# EAGLE design tNode-8 (EAGLE 7.6.0)

## Sheet 1 of 6
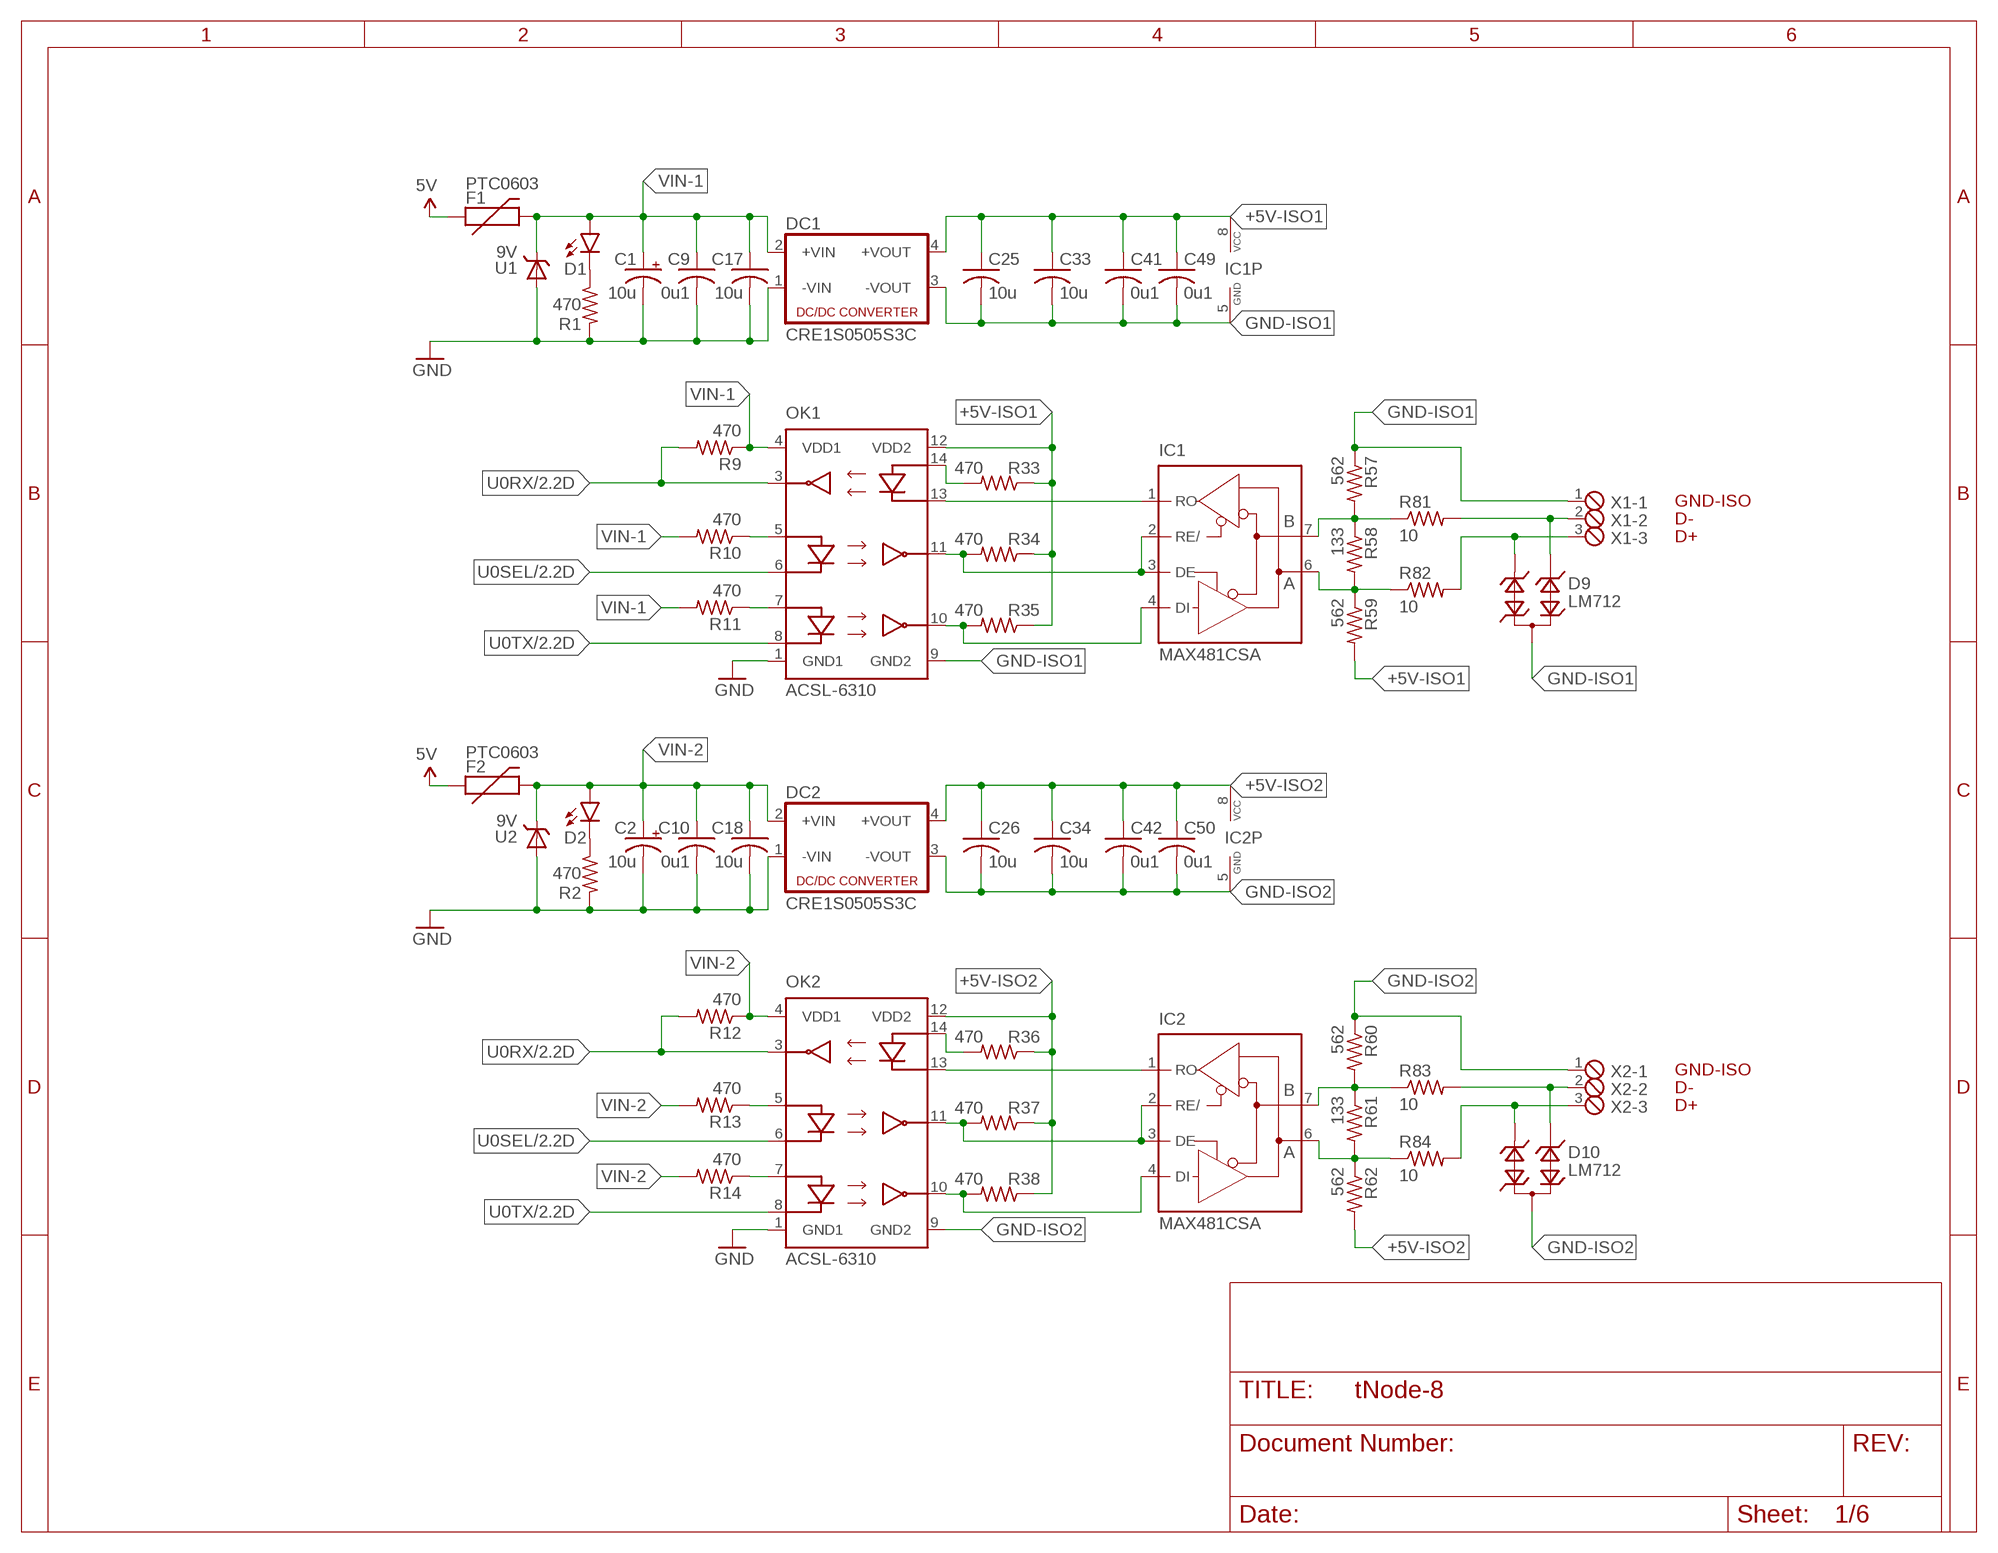
[diagram p0: schematic, sheet 1]

### Parts
C1  10u  CPOL-USE2.5-5-NOSILK  [E2,5-5-NOSILK]
C2  10u  CPOL-USE2.5-5-NOSILK  [E2,5-5-NOSILK]
C9  0u1  C-USC0603K  [C0603K]
C10  0u1  C-USC0603K  [C0603K]
C17  10u  C-USC0603K  [C0603K]
C18  10u  C-USC0603K  [C0603K]
C25  10u  C-USC0603K  [C0603K]
C26  10u  C-USC0603K  [C0603K]
C33  10u  C-USC0603K  [C0603K]
C34  10u  C-USC0603K  [C0603K]
C41  0u1  C-USC0603K  [C0603K]
C42  0u1  C-USC0603K  [C0603K]
C49  0u1  C-USC0603K  [C0603K]
C50  0u1  C-USC0603K  [C0603K]
D1  LED0603  [LED-0603]
D2  LED0603  [LED-0603]
D9  LM712  CDSOT23-SM712SOT23-STANDARD  [SOT23]
D10  LM712  CDSOT23-SM712SOT23-STANDARD  [SOT23]
DC1  CRE1S0505S3C  VA-0505S  [4SIL]
DC2  CRE1S0505S3C  VA-0505S  [4SIL]
F1  PTC0603  [0603]
F2  PTC0603  [0603]
IC1  MAX481CSA  [SO08]
IC2  MAX481CSA  [SO08]
OK1  ACSL-6310  ACSL-60  [SO-16]
OK2  ACSL-6310  ACSL-60  [SO-16]
R1  470  R-US_R0603  [R0603]
R2  470  R-US_R0603  [R0603]
R9  470  R-US_R0603  [R0603]
R10  470  R-US_R0603  [R0603]
R11  470  R-US_R0603  [R0603]
R12  470  R-US_R0603  [R0603]
R13  470  R-US_R0603  [R0603]
R14  470  R-US_R0603  [R0603]
R33  470  R-US_R0603  [R0603]
R34  470  R-US_R0603  [R0603]
R35  470  R-US_R0603  [R0603]
R36  470  R-US_R0603  [R0603]
R37  470  R-US_R0603  [R0603]
R38  470  R-US_R0603  [R0603]
R57  562  R-US_R0603  [R0603]
R58  133  R-US_R0603  [R0603]
R59  562  R-US_R0603  [R0603]
R60  562  R-US_R0603  [R0603]
R61  133  R-US_R0603  [R0603]
R62  562  R-US_R0603  [R0603]
R81  10  R-US_R0603  [R0603]
R82  10  R-US_R0603  [R0603]
R83  10  R-US_R0603  [R0603]
R84  10  R-US_R0603  [R0603]
U1  9V  TVS-DIODESOD323-NOSILK  [SOD323-NOSILK]
U2  9V  TVS-DIODESOD323-NOSILK  [SOD323-NOSILK]
X1  MPT3  [3POL254]
X2  MPT3  [3POL254]

### Nets
5V: F1.1 F2.1 ; also sheet 2,3,4,5
+5V-ISO1: C25.1 C33.1 C41.1 C49.1 DC1.4(+VOUT) IC1.8(VCC) OK1.12(VDD2) R33.1 R34.1 R35.1 R59.2
+5V-ISO2: C26.1 C34.1 C42.1 C50.1 DC2.4(+VOUT) IC2.8(VCC) OK2.12(VDD2) R36.1 R37.1 R38.1 R62.2
GND: C1.- C2.- C9.2 C10.2 C17.2 C18.2 DC1.1(-VIN) DC2.1(-VIN) OK1.1(GND1) OK2.1(GND1) R1.2 R2.2 U1.A U2.A ; also sheet 2,3,4,5
GND-ISO1: C25.2 C33.2 C41.2 C49.2 D9.3 DC1.3(-VOUT) IC1.5(GND) OK1.9(GND2) R57.1 X1.1
GND-ISO2: C26.2 C34.2 C42.2 C50.2 D10.3 DC2.3(-VOUT) IC2.5(GND) OK2.9(GND2) R60.1 X2.1
N$1: IC2.7(B) R60.2 R61.1 R83.1
N$2: IC1.7(B) R57.2 R58.1 R81.1
N$3: IC1.6(A) R58.2 R59.1 R82.1
N$4: IC2.6(A) R61.2 R62.1 R84.1
N$5: IC2.1(RO) OK2.13(C3)
N$6: IC2.2(RE/) IC2.3(DE) OK2.11(VO1) R37.2
N$7: OK2.5(A1) R13.1
N$8: OK2.7(A2) R14.1
N$9: OK2.14(A3) R36.2
N$10: IC1.1(RO) OK1.13(C3)
N$11: D2.C R2.1
N$12: D10.1 R83.2 X2.2
N$13: D10.2 R84.2 X2.3
N$18: IC1.2(RE/) IC1.3(DE) OK1.11(VO1) R34.2
N$19: OK1.5(A1) R10.1
N$21: OK1.7(A2) R11.1
N$23: OK1.14(A3) R33.2
N$25: D1.C R1.1
N$27: D9.1 R81.2 X1.2
N$28: D9.2 R82.2 X1.3
OPTO-OUT1: IC1.4(DI) OK1.10(VO2) R35.2
OPTO-OUT2: IC2.4(DI) OK2.10(VO2) R38.2
U0RX: OK1.3(V03) OK2.3(V03) R9.2 R12.2 ; also sheet 2,3,4,5
U0SEL: OK1.6(C1) OK2.6(C1) ; also sheet 2,3,4
U0TX: OK1.8(C2) OK2.8(C2) ; also sheet 2,3,4,5
VIN-1: C1.+ C9.1 C17.1 D1.A DC1.2(+VIN) F1.2 OK1.4(VDD1) R9.1 R10.2 R11.2 U1.C
VIN-2: C2.+ C10.1 C18.1 D2.A DC2.2(+VIN) F2.2 OK2.4(VDD1) R12.1 R13.2 R14.2 U2.C

### Notes on the sheet
- GND-ISO
- D-
- D+
- GND-ISO
- D-
- D+

## Sheet 2 of 6
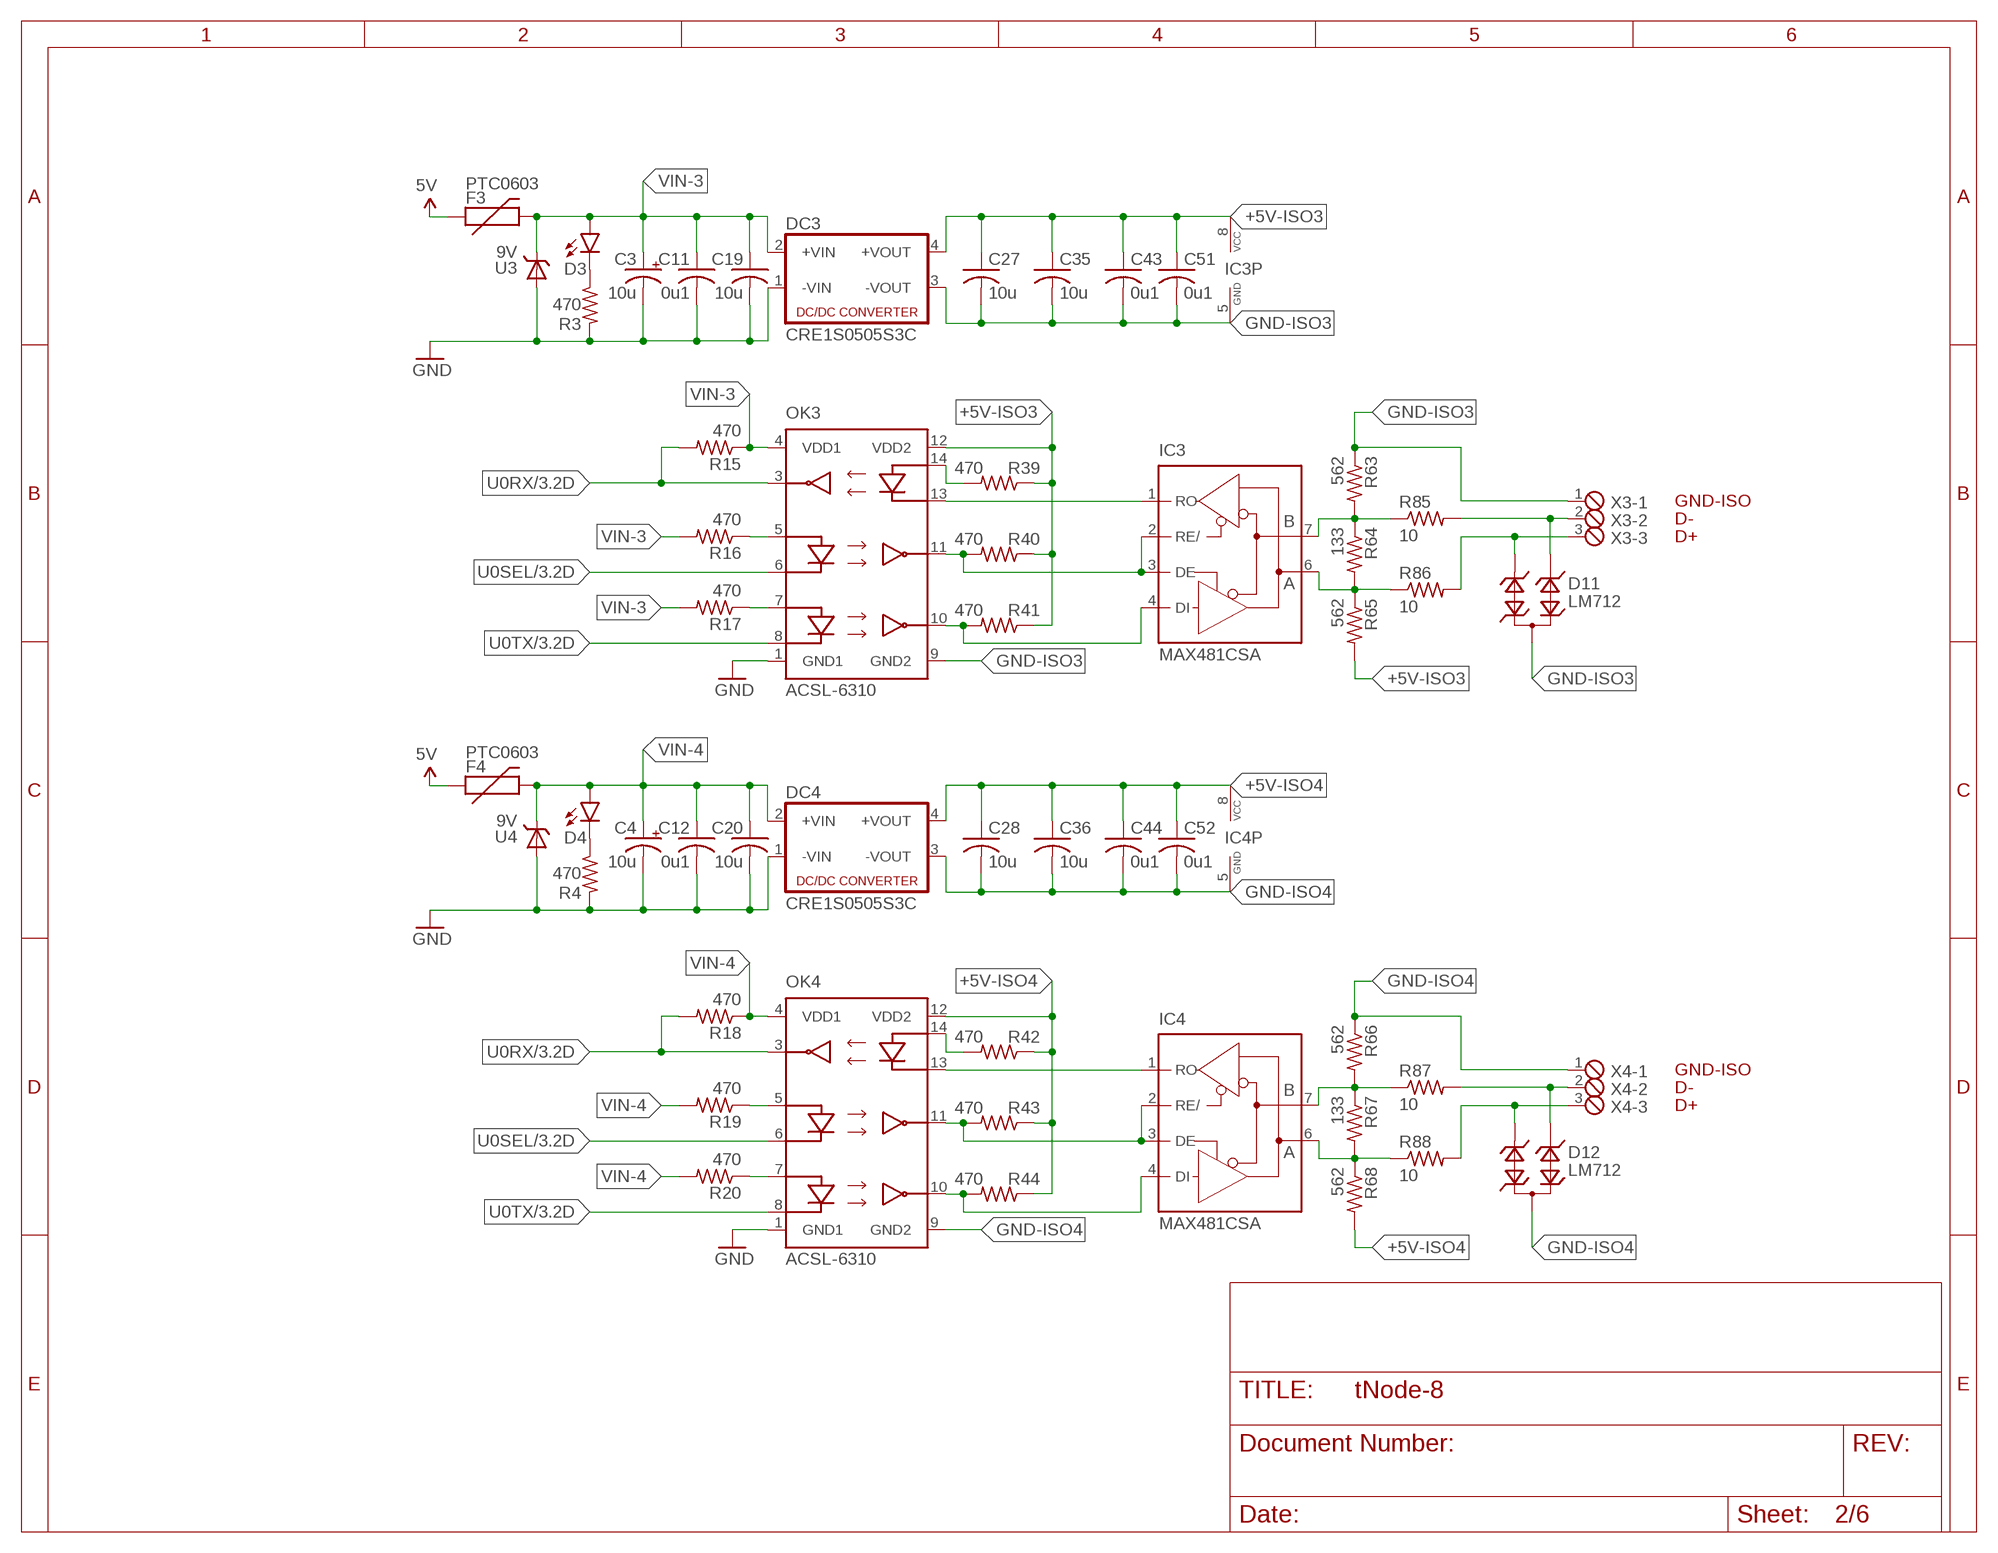
[diagram p1: schematic, sheet 2]

### Parts
C3  10u  CPOL-USE2.5-5-NOSILK  [E2,5-5-NOSILK]
C4  10u  CPOL-USE2.5-5-NOSILK  [E2,5-5-NOSILK]
C11  0u1  C-USC0603K  [C0603K]
C12  0u1  C-USC0603K  [C0603K]
C19  10u  C-USC0603K  [C0603K]
C20  10u  C-USC0603K  [C0603K]
C27  10u  C-USC0603K  [C0603K]
C28  10u  C-USC0603K  [C0603K]
C35  10u  C-USC0603K  [C0603K]
C36  10u  C-USC0603K  [C0603K]
C43  0u1  C-USC0603K  [C0603K]
C44  0u1  C-USC0603K  [C0603K]
C51  0u1  C-USC0603K  [C0603K]
C52  0u1  C-USC0603K  [C0603K]
D3  LED0603  [LED-0603]
D4  LED0603  [LED-0603]
D11  LM712  CDSOT23-SM712SOT23-STANDARD  [SOT23]
D12  LM712  CDSOT23-SM712SOT23-STANDARD  [SOT23]
DC3  CRE1S0505S3C  VA-0505S  [4SIL]
DC4  CRE1S0505S3C  VA-0505S  [4SIL]
F3  PTC0603  [0603]
F4  PTC0603  [0603]
IC3  MAX481CSA  [SO08]
IC4  MAX481CSA  [SO08]
OK3  ACSL-6310  ACSL-60  [SO-16]
OK4  ACSL-6310  ACSL-60  [SO-16]
R3  470  R-US_R0603  [R0603]
R4  470  R-US_R0603  [R0603]
R15  470  R-US_R0603  [R0603]
R16  470  R-US_R0603  [R0603]
R17  470  R-US_R0603  [R0603]
R18  470  R-US_R0603  [R0603]
R19  470  R-US_R0603  [R0603]
R20  470  R-US_R0603  [R0603]
R39  470  R-US_R0603  [R0603]
R40  470  R-US_R0603  [R0603]
R41  470  R-US_R0603  [R0603]
R42  470  R-US_R0603  [R0603]
R43  470  R-US_R0603  [R0603]
R44  470  R-US_R0603  [R0603]
R63  562  R-US_R0603  [R0603]
R64  133  R-US_R0603  [R0603]
R65  562  R-US_R0603  [R0603]
R66  562  R-US_R0603  [R0603]
R67  133  R-US_R0603  [R0603]
R68  562  R-US_R0603  [R0603]
R85  10  R-US_R0603  [R0603]
R86  10  R-US_R0603  [R0603]
R87  10  R-US_R0603  [R0603]
R88  10  R-US_R0603  [R0603]
U3  9V  TVS-DIODESOD323-NOSILK  [SOD323-NOSILK]
U4  9V  TVS-DIODESOD323-NOSILK  [SOD323-NOSILK]
X3  MPT3  [3POL254]
X4  MPT3  [3POL254]

### Nets
5V: F3.1 F4.1 ; also sheet 1,3,4,5
+5V-ISO3: C27.1 C35.1 C43.1 C51.1 DC3.4(+VOUT) IC3.8(VCC) OK3.12(VDD2) R39.1 R40.1 R41.1 R65.2
+5V-ISO4: C28.1 C36.1 C44.1 C52.1 DC4.4(+VOUT) IC4.8(VCC) OK4.12(VDD2) R42.1 R43.1 R44.1 R68.2
GND: C3.- C4.- C11.2 C12.2 C19.2 C20.2 DC3.1(-VIN) DC4.1(-VIN) OK3.1(GND1) OK4.1(GND1) R3.2 R4.2 U3.A U4.A ; also sheet 1,3,4,5
GND-ISO3: C27.2 C35.2 C43.2 C51.2 D11.3 DC3.3(-VOUT) IC3.5(GND) OK3.9(GND2) R63.1 X3.1
GND-ISO4: C28.2 C36.2 C44.2 C52.2 D12.3 DC4.3(-VOUT) IC4.5(GND) OK4.9(GND2) R66.1 X4.1
N$14: IC3.7(B) R63.2 R64.1 R85.1
N$15: IC3.6(A) R64.2 R65.1 R86.1
N$16: IC3.1(RO) OK3.13(C3)
N$17: IC3.2(RE/) IC3.3(DE) OK3.11(VO1) R40.2
N$20: OK3.5(A1) R16.1
N$22: OK3.7(A2) R17.1
N$24: OK3.14(A3) R39.2
N$26: D3.C R3.1
N$29: D11.1 R85.2 X3.2
N$30: D11.2 R86.2 X3.3
N$31: IC4.7(B) R66.2 R67.1 R87.1
N$33: IC4.6(A) R67.2 R68.1 R88.1
N$35: IC4.1(RO) OK4.13(C3)
N$36: IC4.2(RE/) IC4.3(DE) OK4.11(VO1) R43.2
N$37: OK4.5(A1) R19.1
N$38: OK4.7(A2) R20.1
N$39: OK4.14(A3) R42.2
N$40: D4.C R4.1
N$41: D12.1 R87.2 X4.2
N$42: D12.2 R88.2 X4.3
OPTO-OUT3: IC3.4(DI) OK3.10(VO2) R41.2
OPTO-OUT4: IC4.4(DI) OK4.10(VO2) R44.2
U0RX: OK3.3(V03) OK4.3(V03) R15.2 R18.2 ; also sheet 1,3,4,5
U0SEL: OK3.6(C1) OK4.6(C1) ; also sheet 1,3,4
U0TX: OK3.8(C2) OK4.8(C2) ; also sheet 1,3,4,5
VIN-3: C3.+ C11.1 C19.1 D3.A DC3.2(+VIN) F3.2 OK3.4(VDD1) R15.1 R16.2 R17.2 U3.C
VIN-4: C4.+ C12.1 C20.1 D4.A DC4.2(+VIN) F4.2 OK4.4(VDD1) R18.1 R19.2 R20.2 U4.C

### Notes on the sheet
- GND-ISO
- D-
- D+
- GND-ISO
- D-
- D+

## Sheet 3 of 6
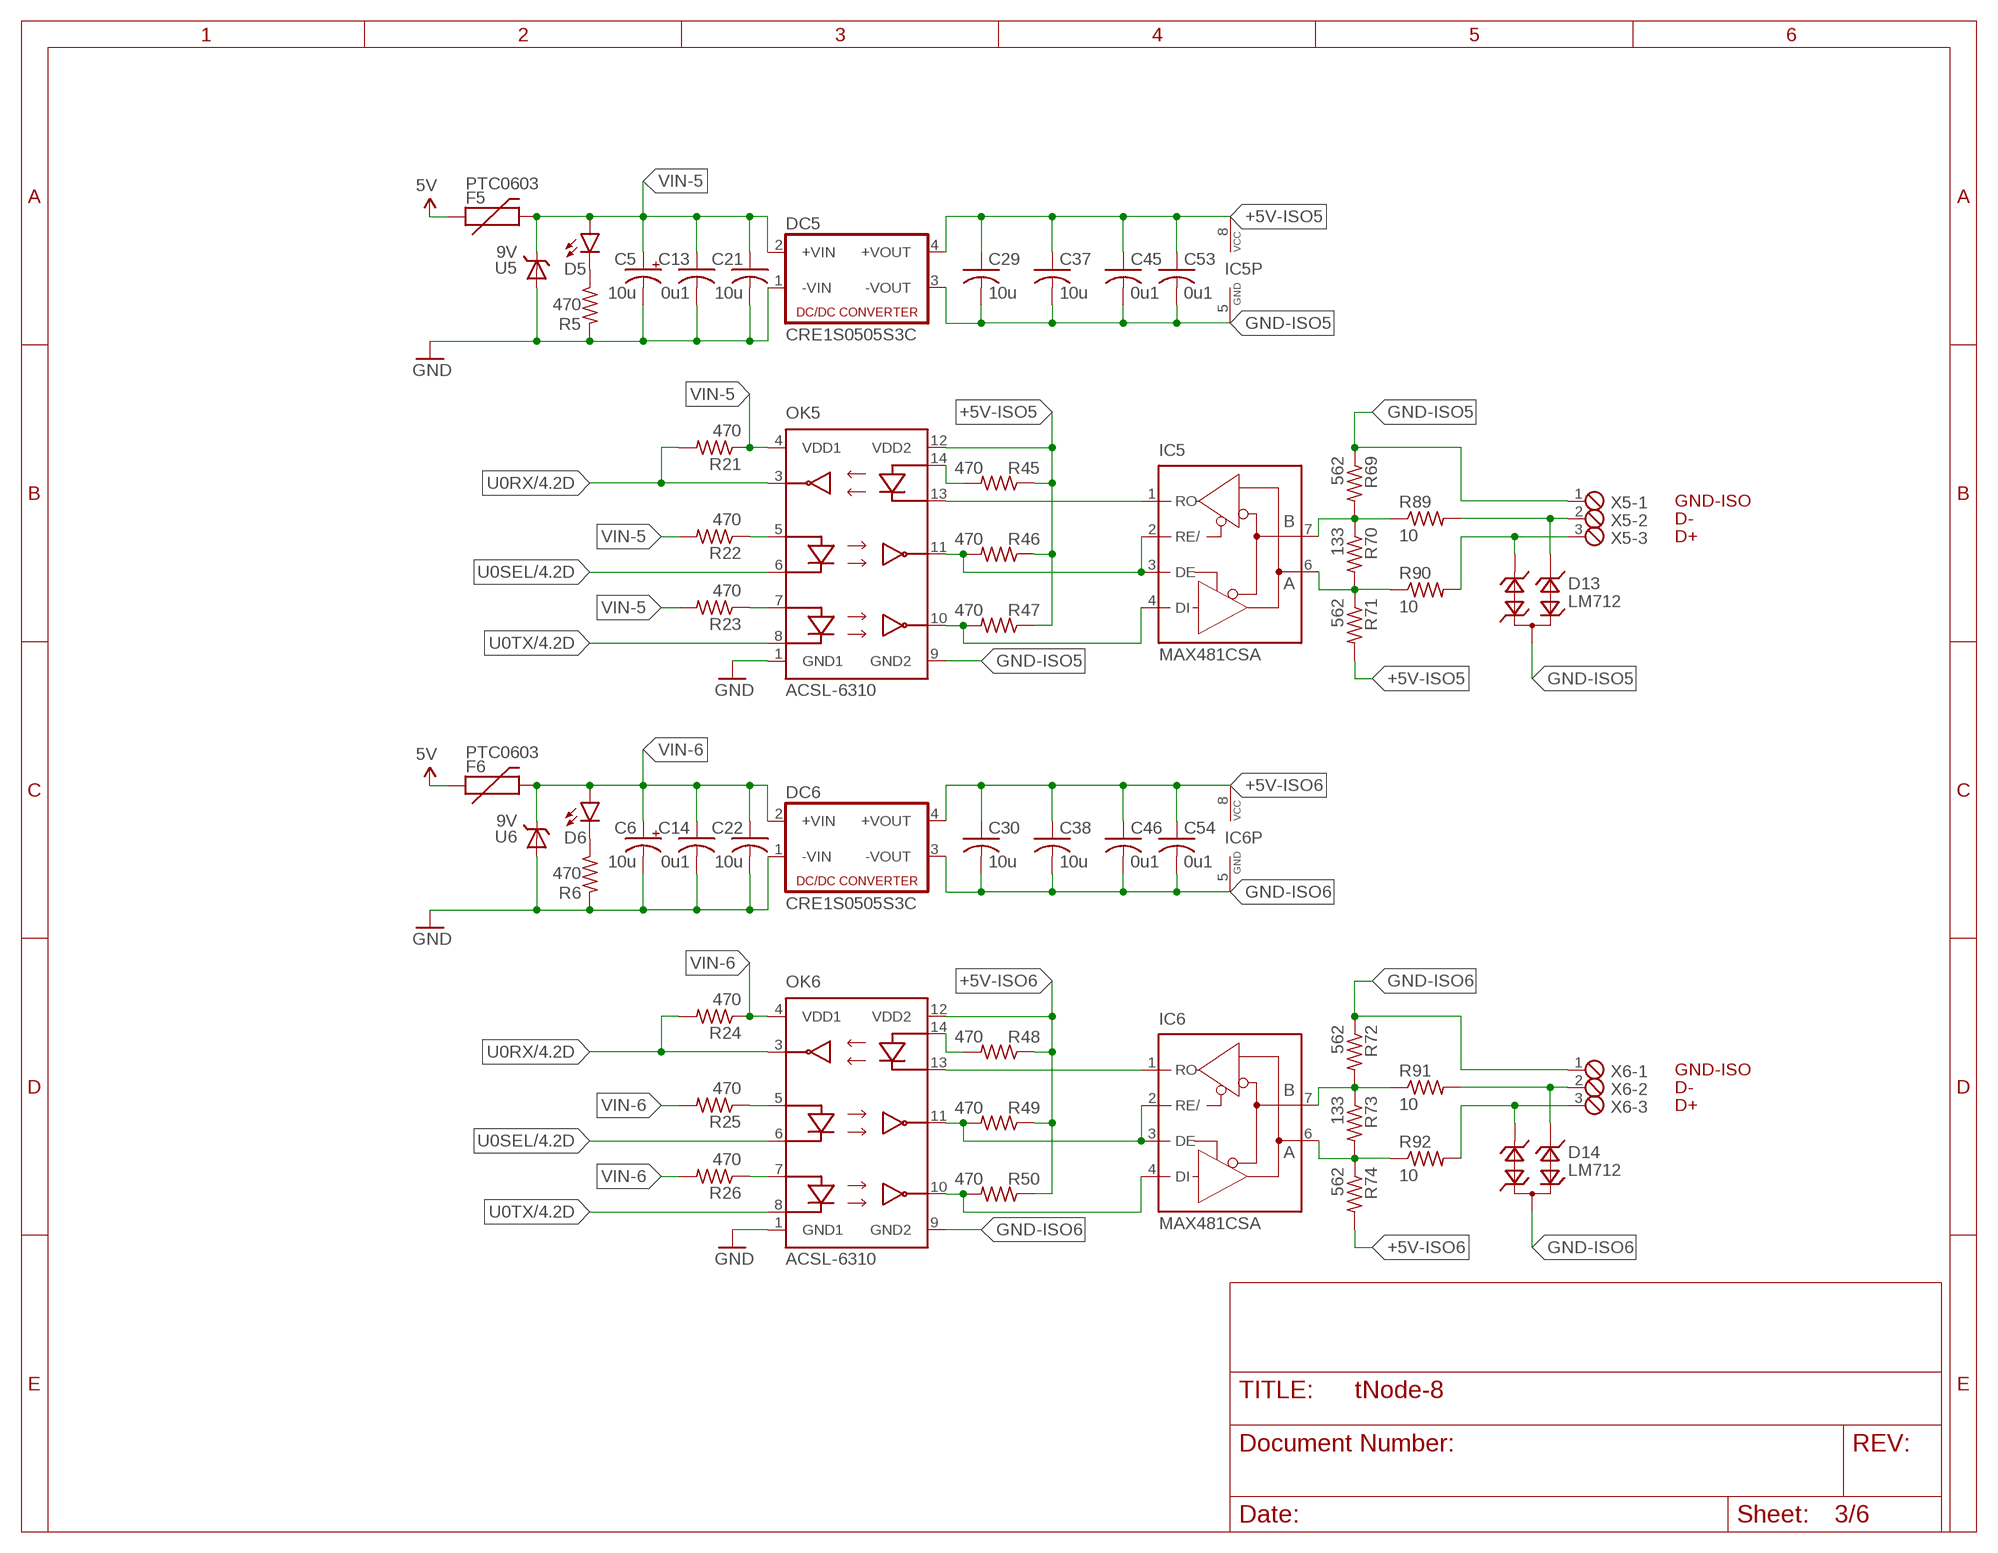
[diagram p2: schematic, sheet 3]

### Parts
C5  10u  CPOL-USE2.5-5-NOSILK  [E2,5-5-NOSILK]
C6  10u  CPOL-USE2.5-5-NOSILK  [E2,5-5-NOSILK]
C13  0u1  C-USC0603K  [C0603K]
C14  0u1  C-USC0603K  [C0603K]
C21  10u  C-USC0603K  [C0603K]
C22  10u  C-USC0603K  [C0603K]
C29  10u  C-USC0603K  [C0603K]
C30  10u  C-USC0603K  [C0603K]
C37  10u  C-USC0603K  [C0603K]
C38  10u  C-USC0603K  [C0603K]
C45  0u1  C-USC0603K  [C0603K]
C46  0u1  C-USC0603K  [C0603K]
C53  0u1  C-USC0603K  [C0603K]
C54  0u1  C-USC0603K  [C0603K]
D5  LED0603  [LED-0603]
D6  LED0603  [LED-0603]
D13  LM712  CDSOT23-SM712SOT23-STANDARD  [SOT23]
D14  LM712  CDSOT23-SM712SOT23-STANDARD  [SOT23]
DC5  CRE1S0505S3C  VA-0505S  [4SIL]
DC6  CRE1S0505S3C  VA-0505S  [4SIL]
F5  PTC0603  [0603]
F6  PTC0603  [0603]
IC5  MAX481CSA  [SO08]
IC6  MAX481CSA  [SO08]
OK5  ACSL-6310  ACSL-60  [SO-16]
OK6  ACSL-6310  ACSL-60  [SO-16]
R5  470  R-US_R0603  [R0603]
R6  470  R-US_R0603  [R0603]
R21  470  R-US_R0603  [R0603]
R22  470  R-US_R0603  [R0603]
R23  470  R-US_R0603  [R0603]
R24  470  R-US_R0603  [R0603]
R25  470  R-US_R0603  [R0603]
R26  470  R-US_R0603  [R0603]
R45  470  R-US_R0603  [R0603]
R46  470  R-US_R0603  [R0603]
R47  470  R-US_R0603  [R0603]
R48  470  R-US_R0603  [R0603]
R49  470  R-US_R0603  [R0603]
R50  470  R-US_R0603  [R0603]
R69  562  R-US_R0603  [R0603]
R70  133  R-US_R0603  [R0603]
R71  562  R-US_R0603  [R0603]
R72  562  R-US_R0603  [R0603]
R73  133  R-US_R0603  [R0603]
R74  562  R-US_R0603  [R0603]
R89  10  R-US_R0603  [R0603]
R90  10  R-US_R0603  [R0603]
R91  10  R-US_R0603  [R0603]
R92  10  R-US_R0603  [R0603]
U5  9V  TVS-DIODESOD323-NOSILK  [SOD323-NOSILK]
U6  9V  TVS-DIODESOD323-NOSILK  [SOD323-NOSILK]
X5  MPT3  [3POL254]
X6  MPT3  [3POL254]

### Nets
5V: F5.1 F6.1 ; also sheet 1,2,4,5
+5V-ISO5: C29.1 C37.1 C45.1 C53.1 DC5.4(+VOUT) IC5.8(VCC) OK5.12(VDD2) R45.1 R46.1 R47.1 R71.2
+5V-ISO6: C30.1 C38.1 C46.1 C54.1 DC6.4(+VOUT) IC6.8(VCC) OK6.12(VDD2) R48.1 R49.1 R50.1 R74.2
GND: C5.- C6.- C13.2 C14.2 C21.2 C22.2 DC5.1(-VIN) DC6.1(-VIN) OK5.1(GND1) OK6.1(GND1) R5.2 R6.2 U5.A U6.A ; also sheet 1,2,4,5
GND-ISO5: C29.2 C37.2 C45.2 C53.2 D13.3 DC5.3(-VOUT) IC5.5(GND) OK5.9(GND2) R69.1 X5.1
GND-ISO6: C30.2 C38.2 C46.2 C54.2 D14.3 DC6.3(-VOUT) IC6.5(GND) OK6.9(GND2) R72.1 X6.1
N$43: IC5.7(B) R69.2 R70.1 R89.1
N$44: IC5.6(A) R70.2 R71.1 R90.1
N$45: IC5.1(RO) OK5.13(C3)
N$46: IC5.2(RE/) IC5.3(DE) OK5.11(VO1) R46.2
N$47: OK5.5(A1) R22.1
N$48: OK5.7(A2) R23.1
N$49: OK5.14(A3) R45.2
N$50: D5.C R5.1
N$51: D13.1 R89.2 X5.2
N$52: D13.2 R90.2 X5.3
N$53: IC6.7(B) R72.2 R73.1 R91.1
N$54: IC6.6(A) R73.2 R74.1 R92.1
N$55: IC6.1(RO) OK6.13(C3)
N$56: IC6.2(RE/) IC6.3(DE) OK6.11(VO1) R49.2
N$57: OK6.5(A1) R25.1
N$58: OK6.7(A2) R26.1
N$59: OK6.14(A3) R48.2
N$60: D6.C R6.1
N$61: D14.1 R91.2 X6.2
N$62: D14.2 R92.2 X6.3
OPTO-OUT5: IC5.4(DI) OK5.10(VO2) R47.2
OPTO-OUT6: IC6.4(DI) OK6.10(VO2) R50.2
U0RX: OK5.3(V03) OK6.3(V03) R21.2 R24.2 ; also sheet 1,2,4,5
U0SEL: OK5.6(C1) OK6.6(C1) ; also sheet 1,2,4
U0TX: OK5.8(C2) OK6.8(C2) ; also sheet 1,2,4,5
VIN-5: C5.+ C13.1 C21.1 D5.A DC5.2(+VIN) F5.2 OK5.4(VDD1) R21.1 R22.2 R23.2 U5.C
VIN-6: C6.+ C14.1 C22.1 D6.A DC6.2(+VIN) F6.2 OK6.4(VDD1) R24.1 R25.2 R26.2 U6.C

### Notes on the sheet
- GND-ISO
- D-
- D+
- GND-ISO
- D-
- D+

## Sheet 4 of 6
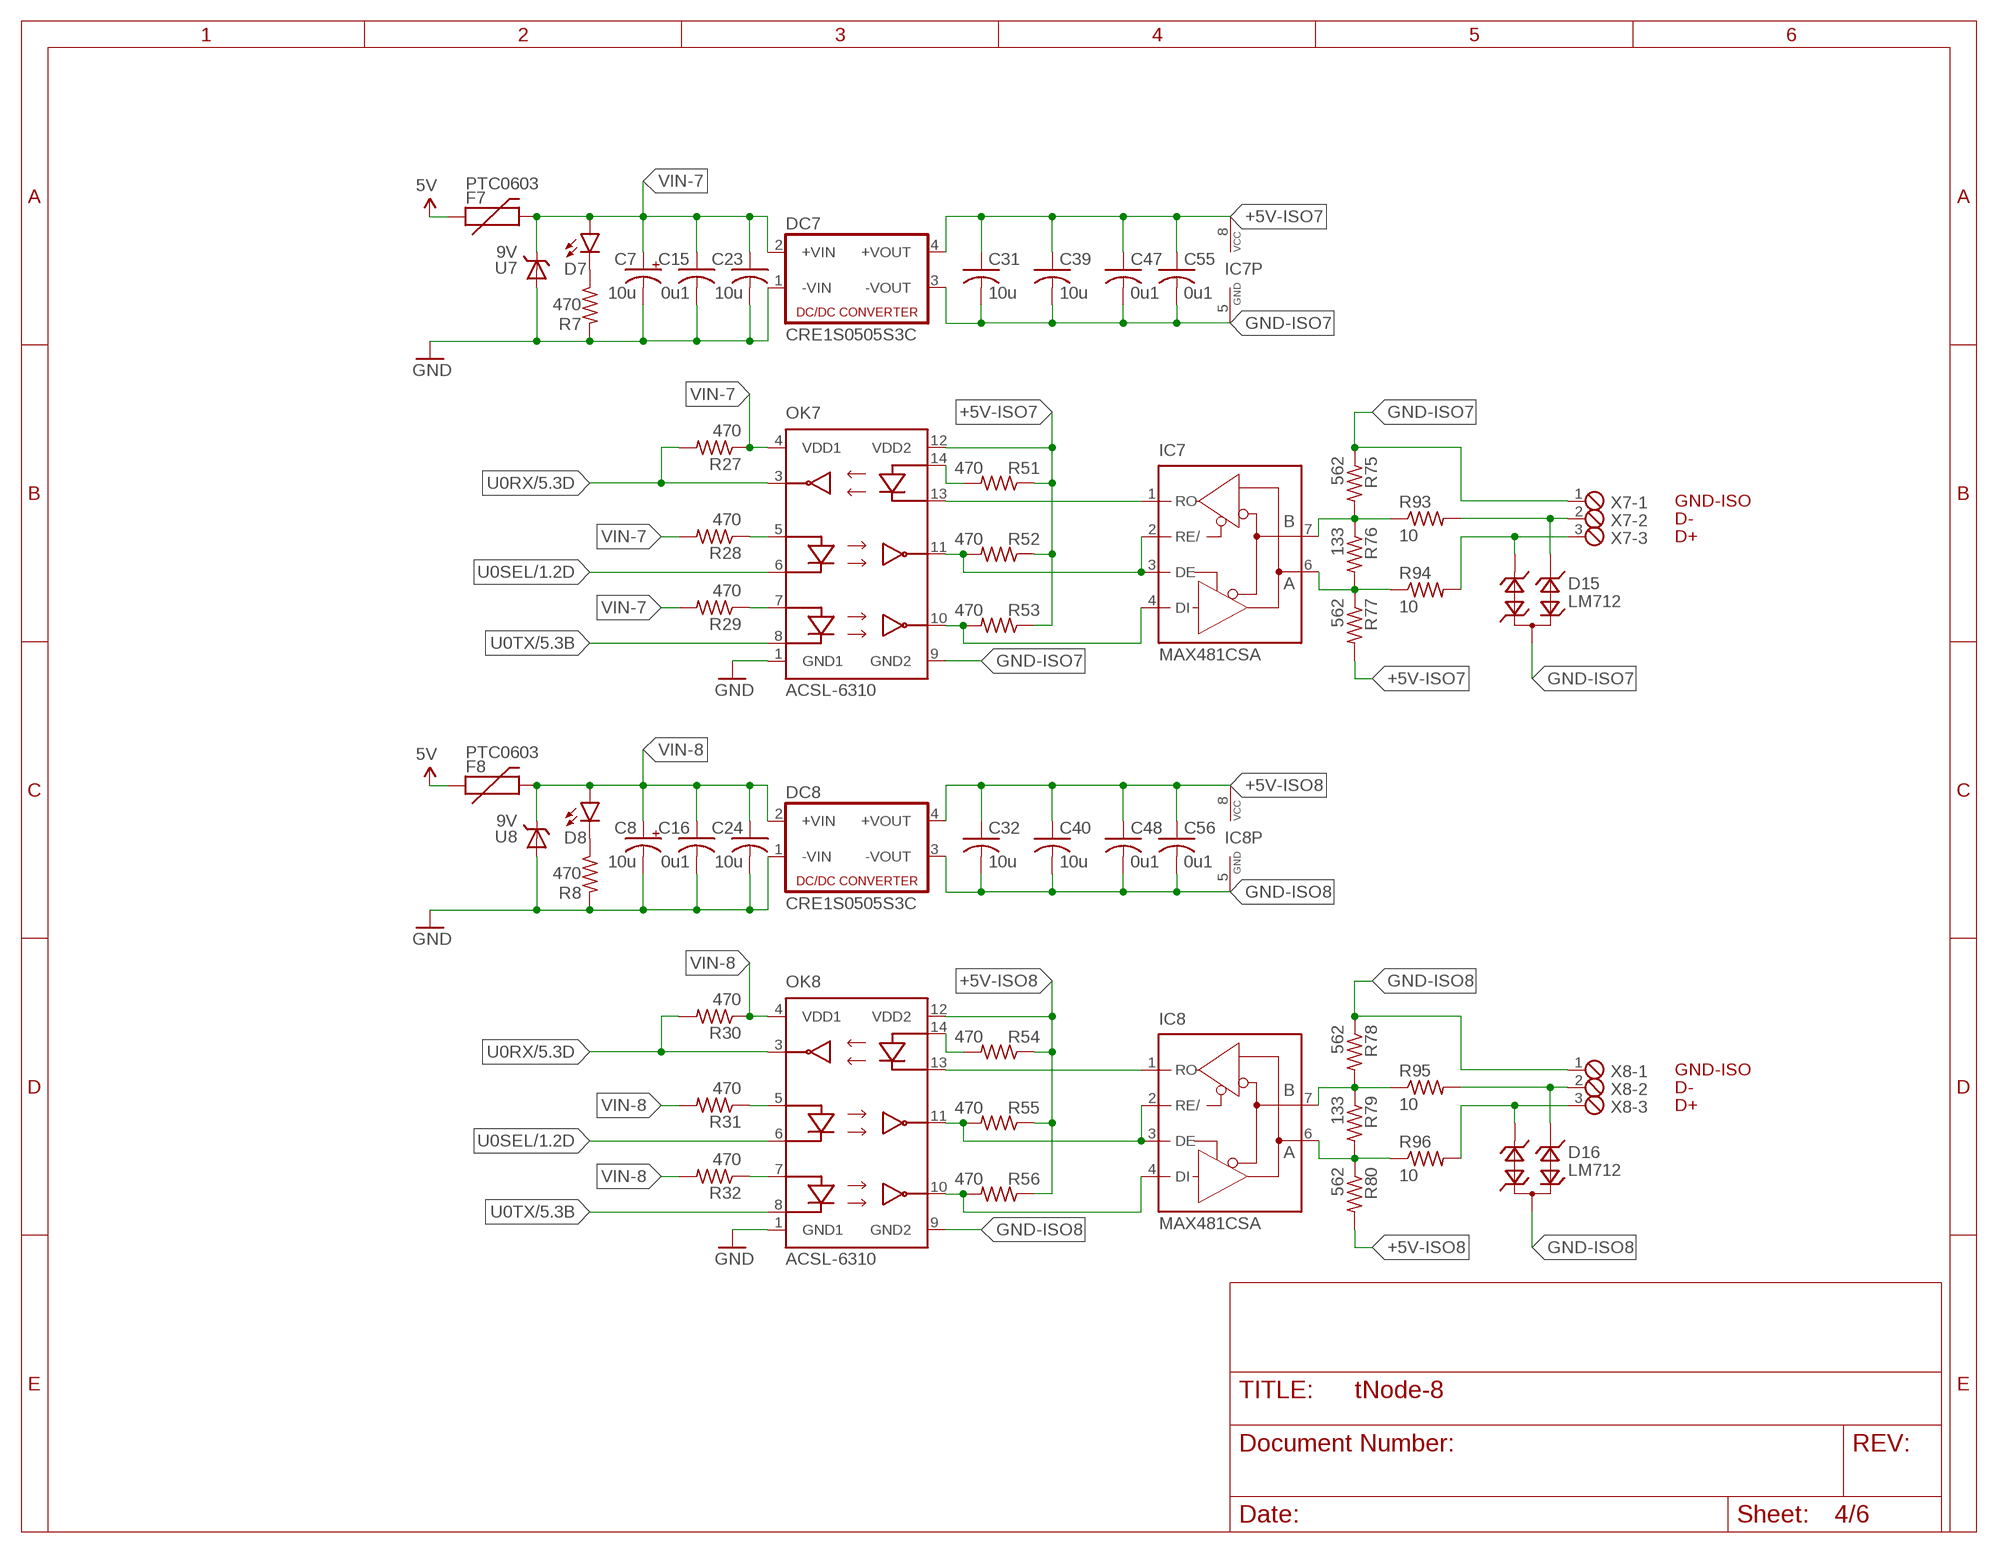
[diagram p3: schematic, sheet 4]

### Parts
C7  10u  CPOL-USE2.5-5-NOSILK  [E2,5-5-NOSILK]
C8  10u  CPOL-USE2.5-5-NOSILK  [E2,5-5-NOSILK]
C15  0u1  C-USC0603K  [C0603K]
C16  0u1  C-USC0603K  [C0603K]
C23  10u  C-USC0603K  [C0603K]
C24  10u  C-USC0603K  [C0603K]
C31  10u  C-USC0603K  [C0603K]
C32  10u  C-USC0603K  [C0603K]
C39  10u  C-USC0603K  [C0603K]
C40  10u  C-USC0603K  [C0603K]
C47  0u1  C-USC0603K  [C0603K]
C48  0u1  C-USC0603K  [C0603K]
C55  0u1  C-USC0603K  [C0603K]
C56  0u1  C-USC0603K  [C0603K]
D7  LED0603  [LED-0603]
D8  LED0603  [LED-0603]
D15  LM712  CDSOT23-SM712SOT23-STANDARD  [SOT23]
D16  LM712  CDSOT23-SM712SOT23-STANDARD  [SOT23]
DC7  CRE1S0505S3C  VA-0505S  [4SIL]
DC8  CRE1S0505S3C  VA-0505S  [4SIL]
F7  PTC0603  [0603]
F8  PTC0603  [0603]
IC7  MAX481CSA  [SO08]
IC8  MAX481CSA  [SO08]
OK7  ACSL-6310  ACSL-60  [SO-16]
OK8  ACSL-6310  ACSL-60  [SO-16]
R7  470  R-US_R0603  [R0603]
R8  470  R-US_R0603  [R0603]
R27  470  R-US_R0603  [R0603]
R28  470  R-US_R0603  [R0603]
R29  470  R-US_R0603  [R0603]
R30  470  R-US_R0603  [R0603]
R31  470  R-US_R0603  [R0603]
R32  470  R-US_R0603  [R0603]
R51  470  R-US_R0603  [R0603]
R52  470  R-US_R0603  [R0603]
R53  470  R-US_R0603  [R0603]
R54  470  R-US_R0603  [R0603]
R55  470  R-US_R0603  [R0603]
R56  470  R-US_R0603  [R0603]
R75  562  R-US_R0603  [R0603]
R76  133  R-US_R0603  [R0603]
R77  562  R-US_R0603  [R0603]
R78  562  R-US_R0603  [R0603]
R79  133  R-US_R0603  [R0603]
R80  562  R-US_R0603  [R0603]
R93  10  R-US_R0603  [R0603]
R94  10  R-US_R0603  [R0603]
R95  10  R-US_R0603  [R0603]
R96  10  R-US_R0603  [R0603]
U7  9V  TVS-DIODESOD323-NOSILK  [SOD323-NOSILK]
U8  9V  TVS-DIODESOD323-NOSILK  [SOD323-NOSILK]
X7  MPT3  [3POL254]
X8  MPT3  [3POL254]

### Nets
5V: F7.1 F8.1 ; also sheet 1,2,3,5
+5V-ISO7: C31.1 C39.1 C47.1 C55.1 DC7.4(+VOUT) IC7.8(VCC) OK7.12(VDD2) R51.1 R52.1 R53.1 R77.2
+5V-ISO8: C32.1 C40.1 C48.1 C56.1 DC8.4(+VOUT) IC8.8(VCC) OK8.12(VDD2) R54.1 R55.1 R56.1 R80.2
GND: C7.- C8.- C15.2 C16.2 C23.2 C24.2 DC7.1(-VIN) DC8.1(-VIN) OK7.1(GND1) OK8.1(GND1) R7.2 R8.2 U7.A U8.A ; also sheet 1,2,3,5
GND-ISO7: C31.2 C39.2 C47.2 C55.2 D15.3 DC7.3(-VOUT) IC7.5(GND) OK7.9(GND2) R75.1 X7.1
GND-ISO8: C32.2 C40.2 C48.2 C56.2 D16.3 DC8.3(-VOUT) IC8.5(GND) OK8.9(GND2) R78.1 X8.1
N$63: IC7.7(B) R75.2 R76.1 R93.1
N$64: IC7.6(A) R76.2 R77.1 R94.1
N$65: IC7.1(RO) OK7.13(C3)
N$66: IC7.2(RE/) IC7.3(DE) OK7.11(VO1) R52.2
N$67: OK7.5(A1) R28.1
N$68: OK7.7(A2) R29.1
N$69: OK7.14(A3) R51.2
N$70: D7.C R7.1
N$71: D15.1 R93.2 X7.2
N$72: D15.2 R94.2 X7.3
N$73: IC8.7(B) R78.2 R79.1 R95.1
N$74: IC8.6(A) R79.2 R80.1 R96.1
N$75: IC8.1(RO) OK8.13(C3)
N$76: IC8.2(RE/) IC8.3(DE) OK8.11(VO1) R55.2
N$77: OK8.5(A1) R31.1
N$78: OK8.7(A2) R32.1
N$79: OK8.14(A3) R54.2
N$80: D8.C R8.1
N$81: D16.1 R95.2 X8.2
N$82: D16.2 R96.2 X8.3
OPTO-OUT7: IC7.4(DI) OK7.10(VO2) R53.2
OPTO-OUT8: IC8.4(DI) OK8.10(VO2) R56.2
U0RX: OK7.3(V03) OK8.3(V03) R27.2 R30.2 ; also sheet 1,2,3,5
U0SEL: OK7.6(C1) OK8.6(C1) ; also sheet 1,2,3
U0TX: OK7.8(C2) OK8.8(C2) ; also sheet 1,2,3,5
VIN-7: C7.+ C15.1 C23.1 D7.A DC7.2(+VIN) F7.2 OK7.4(VDD1) R27.1 R28.2 R29.2 U7.C
VIN-8: C8.+ C16.1 C24.1 D8.A DC8.2(+VIN) F8.2 OK8.4(VDD1) R30.1 R31.2 R32.2 U8.C

### Notes on the sheet
- GND-ISO
- D-
- D+
- GND-ISO
- D-
- D+

## Sheet 5 of 6
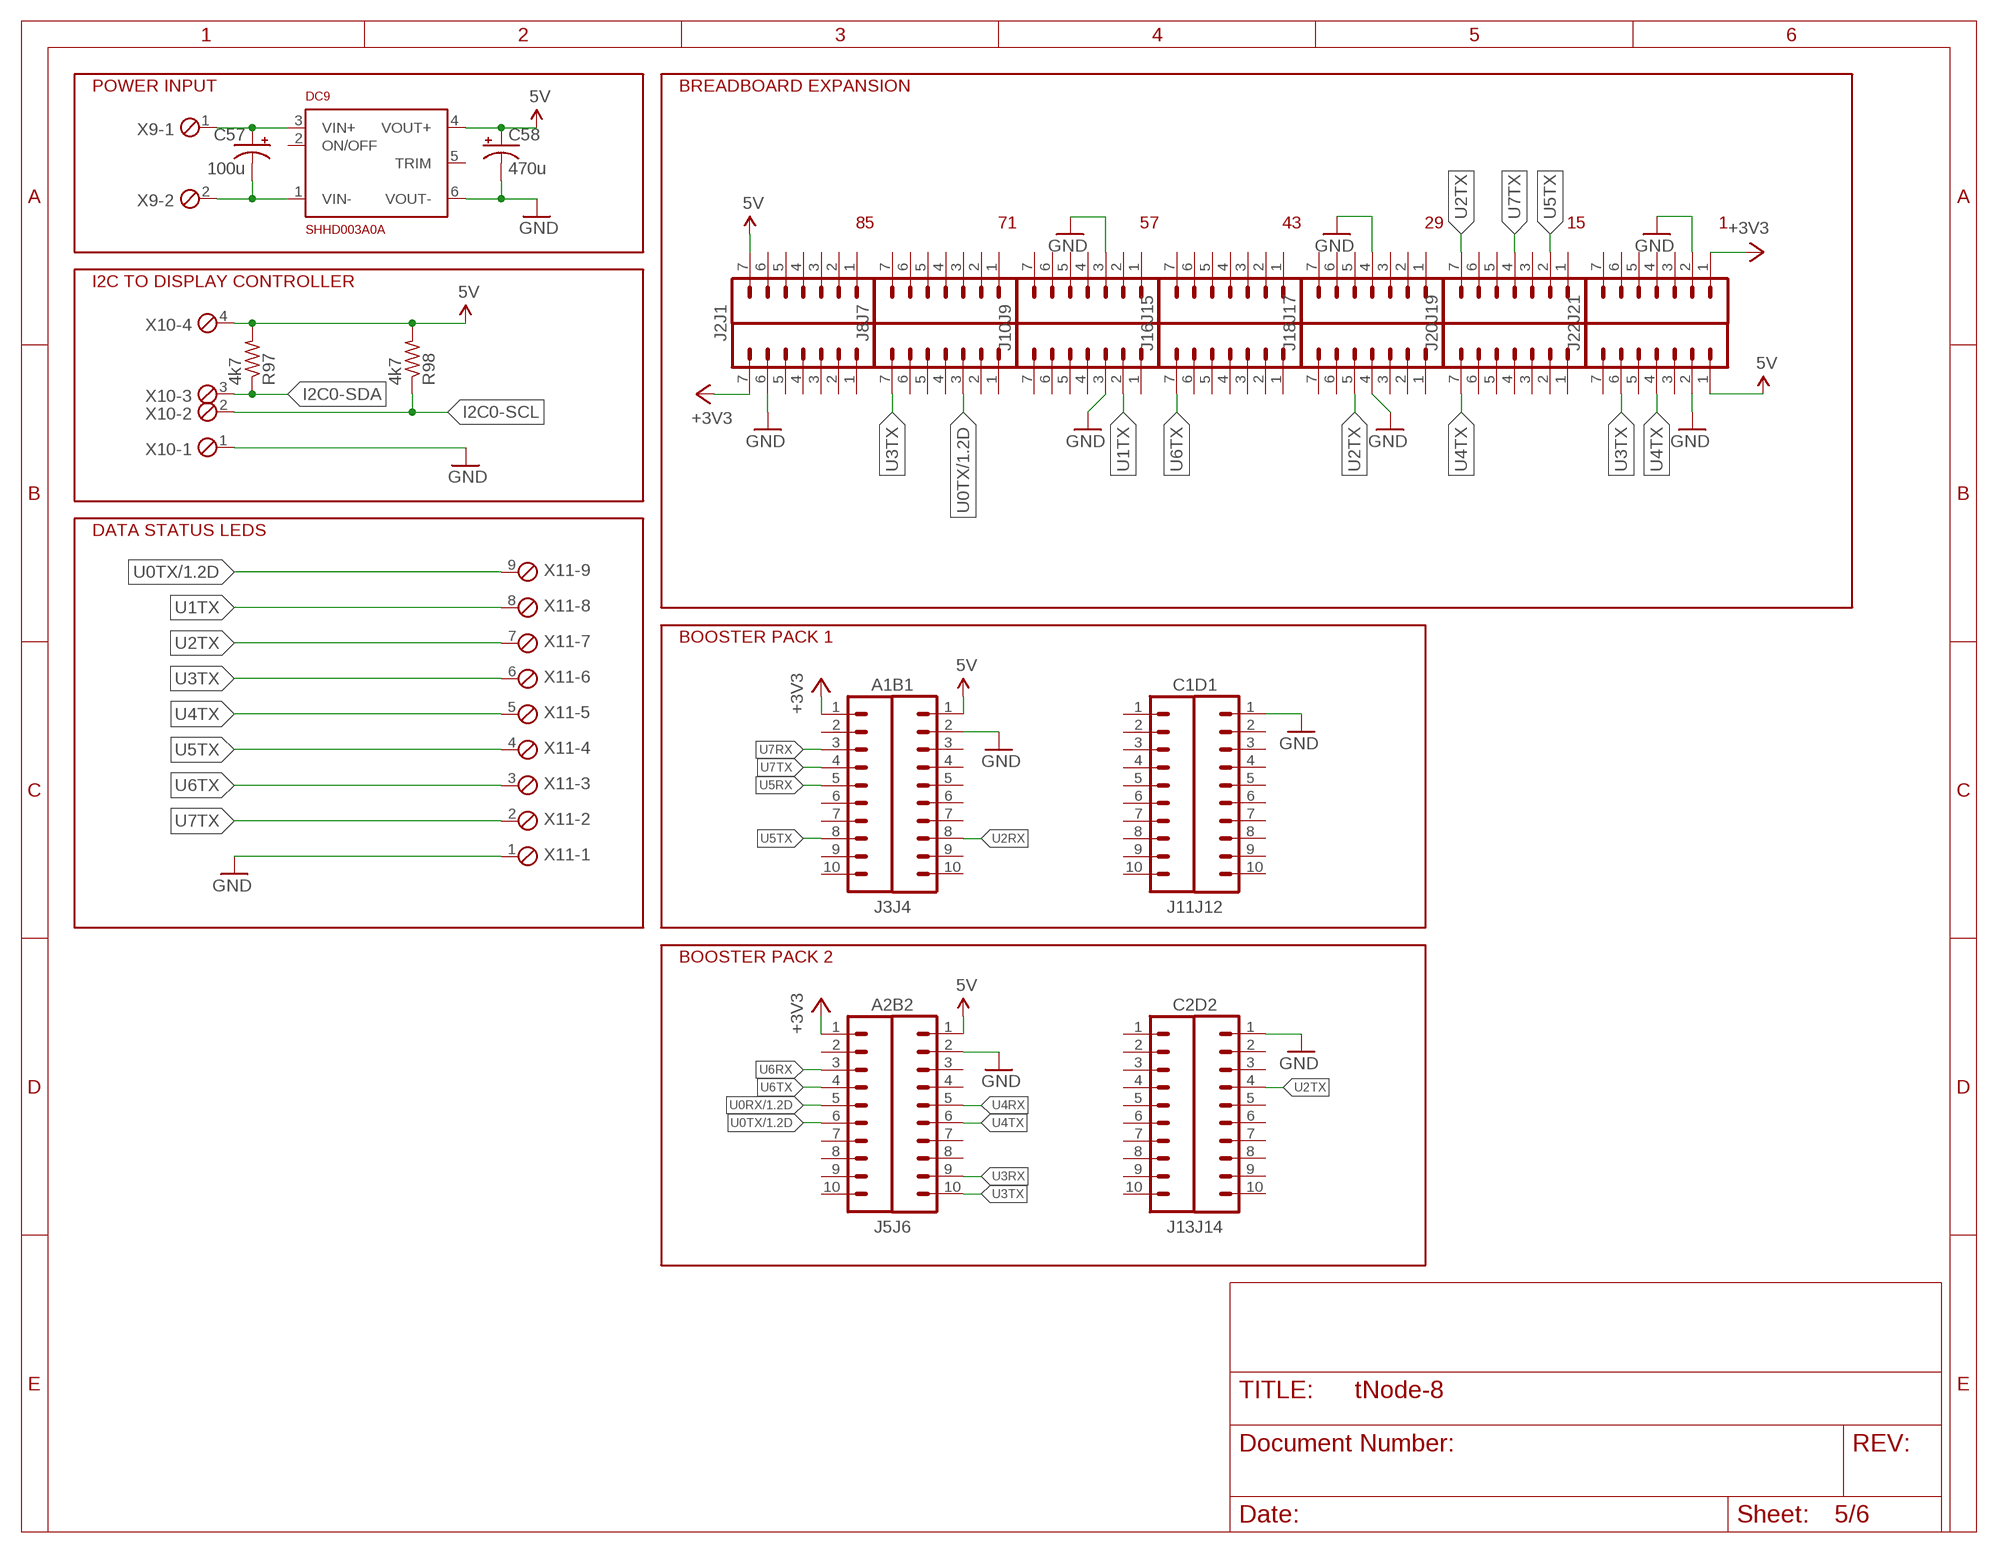
[diagram p4: schematic, sheet 5]

### Parts
C57  100u  CPOL-USD  [PANASONIC_D]
C58  470u  CPOL-USD  [PANASONIC_D]
DC9  SHHD003A0A  [SHHD003A0A]
J1  M07  [1X07]
J2  M07  [1X07]
J3  A1  M10SILK_FEMALE_PTH  [1X10]
J4  B1  M10SILK_FEMALE_PTH  [1X10]
J5  A2  M10SILK_FEMALE_PTH  [1X10]
J6  B2  M10SILK_FEMALE_PTH  [1X10]
J7  M07  [1X07]
J8  M07  [1X07]
J9  M07  [1X07]
J10  M07  [1X07]
J11  C1  M10SILK_FEMALE_PTH  [1X10]
J12  D1  M10SILK_FEMALE_PTH  [1X10]
J13  C2  M10SILK_FEMALE_PTH  [1X10]
J14  D2  M10SILK_FEMALE_PTH  [1X10]
J15  M07  [1X07]
J16  M07  [1X07]
J17  M07  [1X07]
J18  M07  [1X07]
J19  M07  [1X07]
J20  M07  [1X07]
J21  M07  [1X07]
J22  M07  [1X07]
R97  4k7  R-US_R0603  [R0603]
R98  4k7  R-US_R0603  [R0603]
X9  MPT2  [2POL254]
X10  MPT4  [4POL254]
X11  MPT9  [9POL254]

### Nets
5V: C58.+ DC9.4(VOUT+) J1.7 J4.1 J6.1 J22.1 R97.2 R98.2 X10.4 ; also sheet 1,2,3,4
+3V3: J2.7 J3.1 J5.1 J21.1
GND: C58.- DC9.6(VOUT-) J2.6 J4.2 J6.2 J9.3 J10.3 J12.1 J14.1 J17.4 J18.4 J21.2 J22.2 X10.1 X11.1 ; also sheet 1,2,3,4
I2C0-SCL: R98.1 X10.2
I2C0-SDA: R97.1 X10.3
N$32: C57.- DC9.1(VIN-) X9.2
N$34: C57.+ DC9.3(VIN+) X9.1
U0RX: J5.5 ; also sheet 1,2,3,4
U0TX: J5.6 J8.3 X11.9 ; also sheet 1,2,3,4
U1TX: J10.2 X11.8
U2RX: J4.8
U2TX: J14.4 J18.5 J19.7 X11.7
U3RX: J6.9
U3TX: J6.10 J8.7 J22.6 X11.6
U4RX: J6.5
U4TX: J6.6 J20.7 J22.4 X11.5
U5RX: J3.5
U5TX: J3.8 J19.2 X11.4
U6RX: J5.3
U6TX: J5.4 J16.7 X11.3
U7RX: J3.3
U7TX: J3.4 J19.4 X11.2
Unconnected: DC9.2(ON/OFF) DC9.5(TRIM) J1.1 J1.2 J1.3 J1.4 J1.5 J1.6 J2.1 J2.2 J2.3 J2.4 J2.5 J3.2 J3.6 J3.7 J3.9 J3.10 J4.3 J4.4 J4.5 J4.6 J4.7 J4.9 J4.10 J5.2 J5.7 J5.8 J5.9 J5.10 J6.3 J6.4 J6.7 J6.8 J7.1 J7.2 J7.3 J7.4 J7.5 J7.6 J7.7 J8.1 J8.2 J8.4 J8.5 J8.6 J9.1 J9.2 J9.4 J9.5 J9.6 J9.7 J10.1 J10.4 J10.5 J10.6 J10.7 J11.1 J11.2 J11.3 J11.4 J11.5 J11.6 J11.7 J11.8 J11.9 J11.10 J12.2 J12.3 J12.4 J12.5 J12.6 J12.7 J12.8 J12.9 J12.10 J13.1 J13.2 J13.3 J13.4 J13.5 J13.6 J13.7 J13.8 J13.9 J13.10 J14.2 J14.3 J14.5 J14.6 J14.7 J14.8 J14.9 J14.10 J15.1 J15.2 J15.3 J15.4 J15.5 J15.6 J15.7 J16.1 J16.2 J16.3 J16.4 J16.5 J16.6 J17.1 J17.2 J17.3 J17.5 J17.6 J17.7 J18.1 J18.2 J18.3 J18.6 J18.7 J19.1 J19.3 J19.5 J19.6 J20.1 J20.2 J20.3 J20.4 J20.5 J20.6 J21.3 J21.4 J21.5 J21.6 J21.7 J22.3 J22.5 J22.7

### Notes on the sheet
- POWER INPUT | BREADBOARD EXPANSION
- 85 | 71 | 57 | 43 | 29 | 15 | 1
- I2C TO DISPLAY CONTROLLER
- DATA STATUS LEDS
- BOOSTER PACK 1
- BOOSTER PACK 2

## Sheet 6 of 6
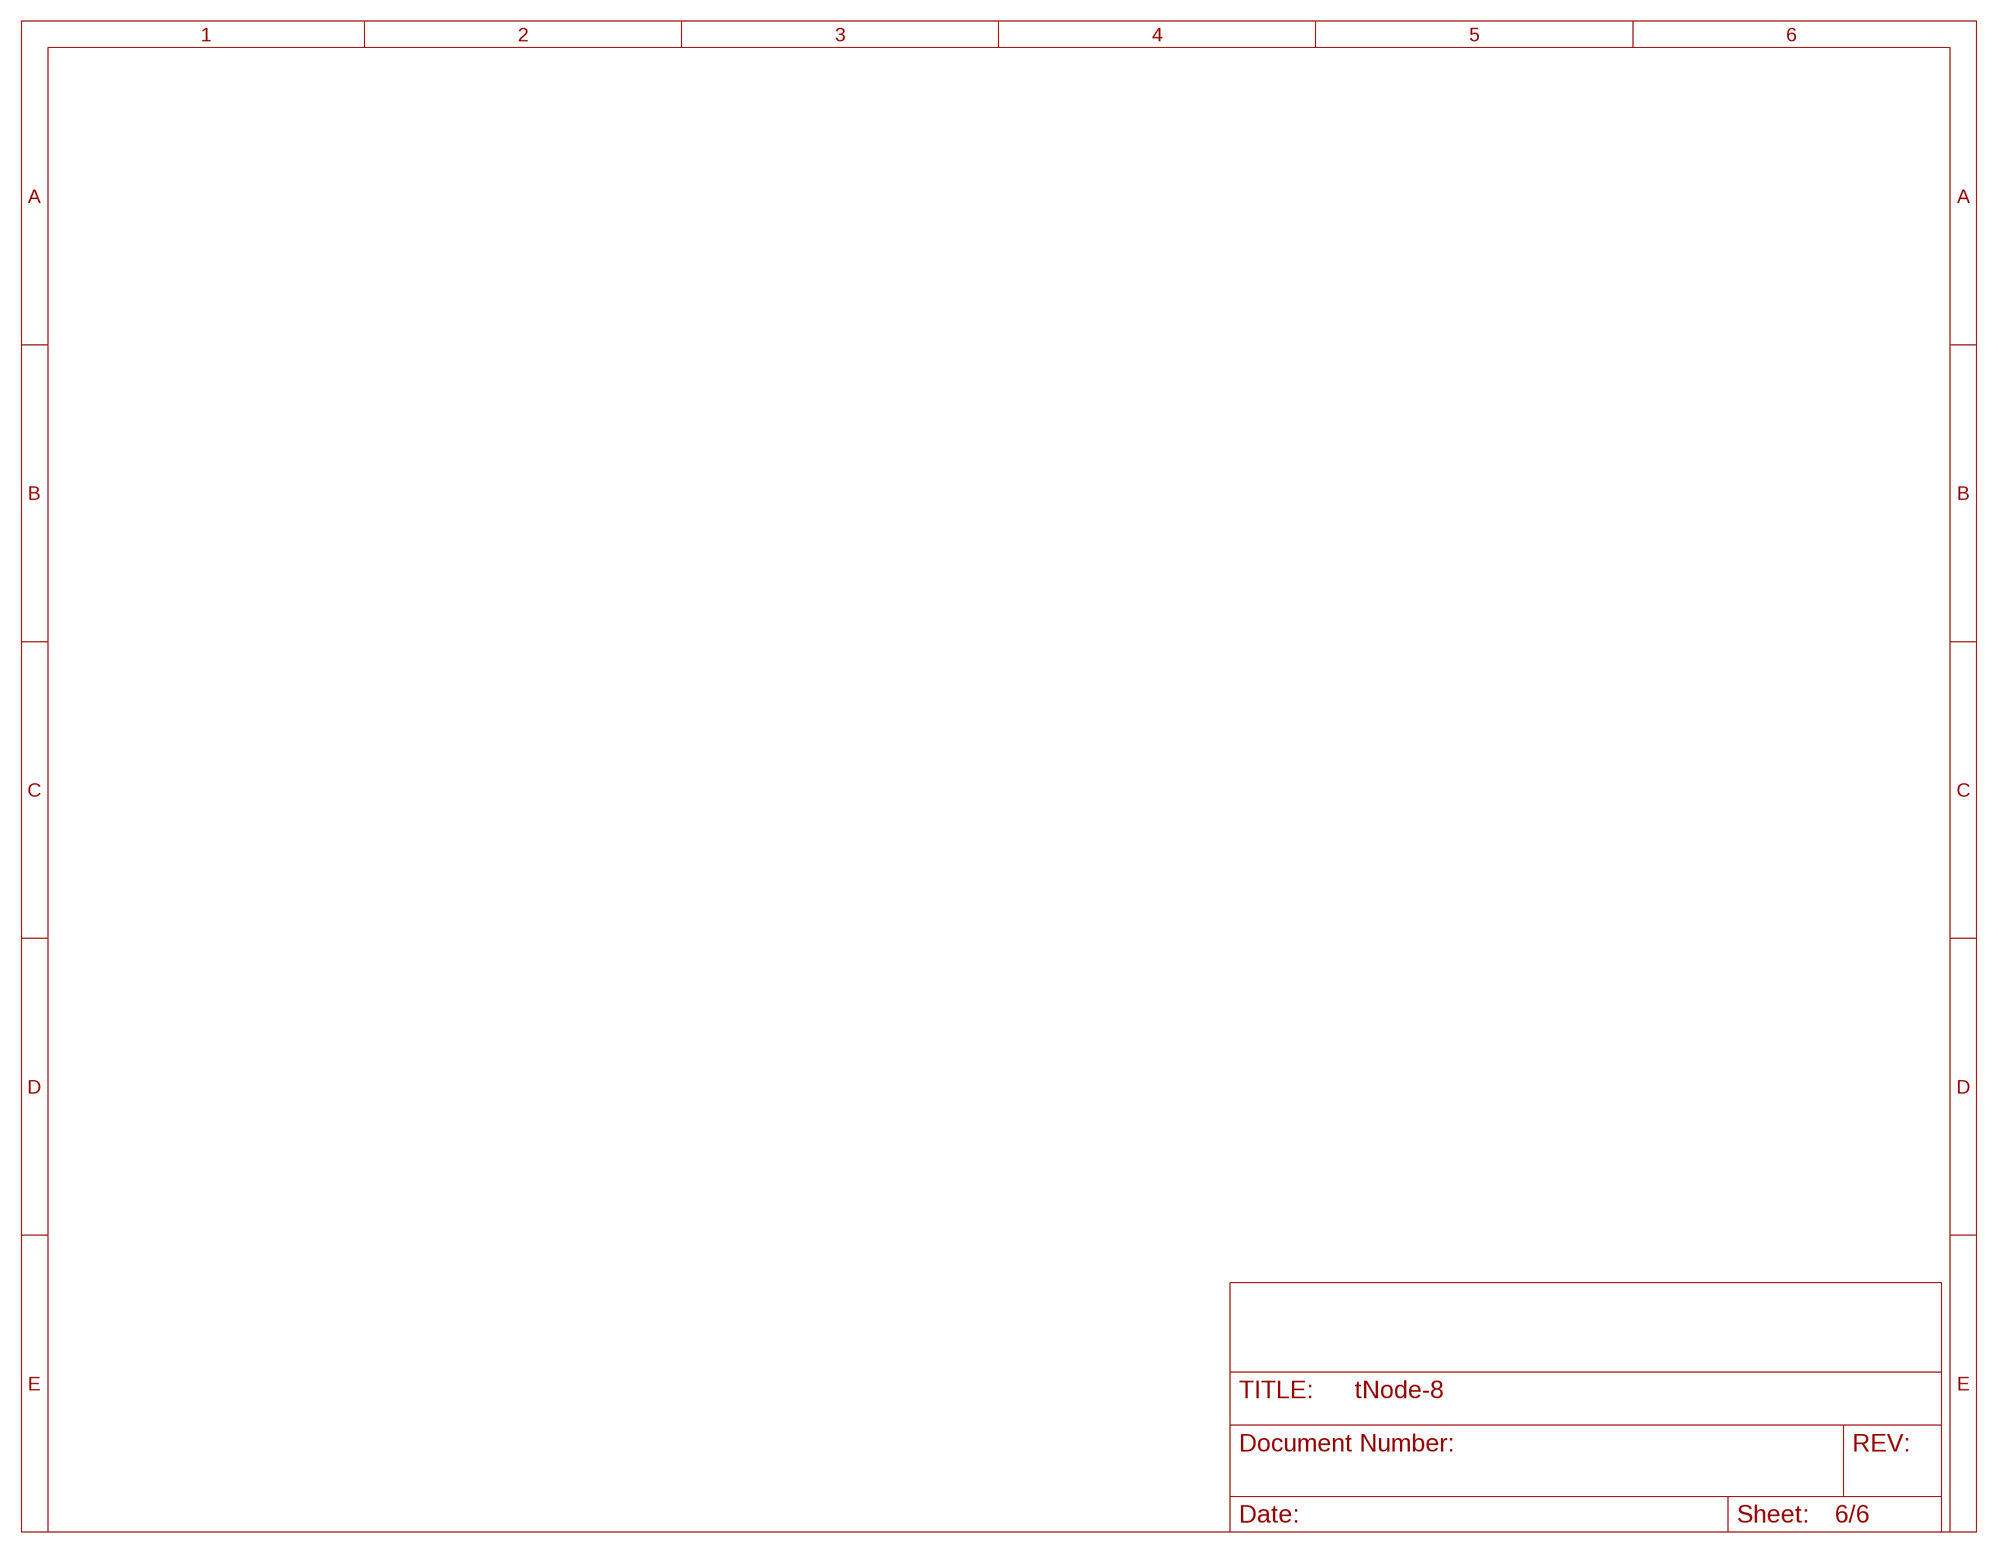
[diagram p5: schematic, sheet 6]

## Library data of the parts
C1-C8 C57 C58 = rcl:CPOL-US: POLARIZED CAPACITOR, American symbol
C9-C56 = rcl:C-US: CAPACITOR, American symbol
D1-D8 = SparkFun-LED:LED: LEDs Standard schematic elements and footprints for 5mm, 3mm, 1206, and 0603 sized LEDs. 5mm - Spark Fun Electronics SKU : COM-00529 (and others)
D9-D16 = diode:CDSOT23-SM712
DC1-DC8 = dc-dc-converter:VA-*?: DC DC Converter Single Output, 1 Watt Motien Technology Co.,Ltd. Source: Data sheet <http://www.motien.com.tw/data_sheet/VA-1%28H%29.pdf>; OC_FARNELL: unknown; OC_NEWARK: unknown
DC9 = dc-dc-converter:SHHD003A0A
F1-F8 = SparkFun-PowerIC:PTC: Resettable Fuse PTC Resettable Fuse. Spark Fun Electronics SKU : COM-08357
IC1-IC8 = maxim:MAX481CSA: RS485 TRANSEIVER; MF: MAXIM; MPN: MAX481CSA; OC_FARNELL: unknown; OC_NEWARK: 90C3817
J1 J2 J7-J10 J15-J22 = SparkFun-Connectors:M07: Header 7 Standard 7-pin 0.1" header. Use with straight break away headers (SKU : PRT-00116), right angle break away headers (PRT-00553), swiss pins (PRT-00743), machine pins (PRT-00117), and female headers (PRT-00115). NOTES ON THE VARIANTS LOCK and LOCK_LONGPADS... This footprint was designed to help hold the alignment of a through-hole component (i.e. 7-pin header) while soldering it into place. You may notice that each hole has been shifted either up or down by 0.005 of an inch from it's more standard position (which is usually a perfectly straight line). This slight alteration caused the pins (the squares in the middle) to touch the edges of the holes. Because they are alternating, it causes a "brace" to hold the header in place. 0.005 has proven to be the perfect amount of "off-center" position when using our standard breakaway headers. Although looks a little odd when you look at the bare footprint, once you have a header in there, the alteration is very hard to notice. Also, if you push a header all the way into place, it is covered up entirely on the bottom side. This idea of altering the position of holes to aid alignment will be further integrated into the Sparkfun Library for other footprints. It can help hold any component with 3 or more connection pins.
J3-J6 J11-J14 = SparkFun-Connectors:M10: Header 10 Standard 10-pin 0.1" header. Use with straight break away headers (SKU : PRT-00116), right angle break away headers (PRT-00553), swiss pins (PRT-00743), machine pins (PRT-00117), and female headers (PRT-00115).; PROD_ID: CONN-11563
OK1-OK8 = optocoupler:ACSL-6**0: MULTI-CHANNEL AND BI-DIRECTIONAL 15MBd OPTOCPUPLER
R1-R98 = rcl:R-US_: RESISTOR, American symbol
U1-U8 = diode:TVS-DIODE
X1-X8 = con-phoenix-254:MPT3: PHOENIX CONNECTOR; OC_FARNELL: unknown; OC_NEWARK: unknown
X9 = con-phoenix-254:MPT2: PHOENIX CONNECTOR; OC_FARNELL: unknown; OC_NEWARK: unknown
X10 = con-phoenix-254:MPT4: PHOENIX CONNECTOR; OC_FARNELL: unknown; OC_NEWARK: unknown
X11 = con-phoenix-254:MPT9: PHOENIX CONNECTOR; OC_FARNELL: unknown; OC_NEWARK: unknown

## Board
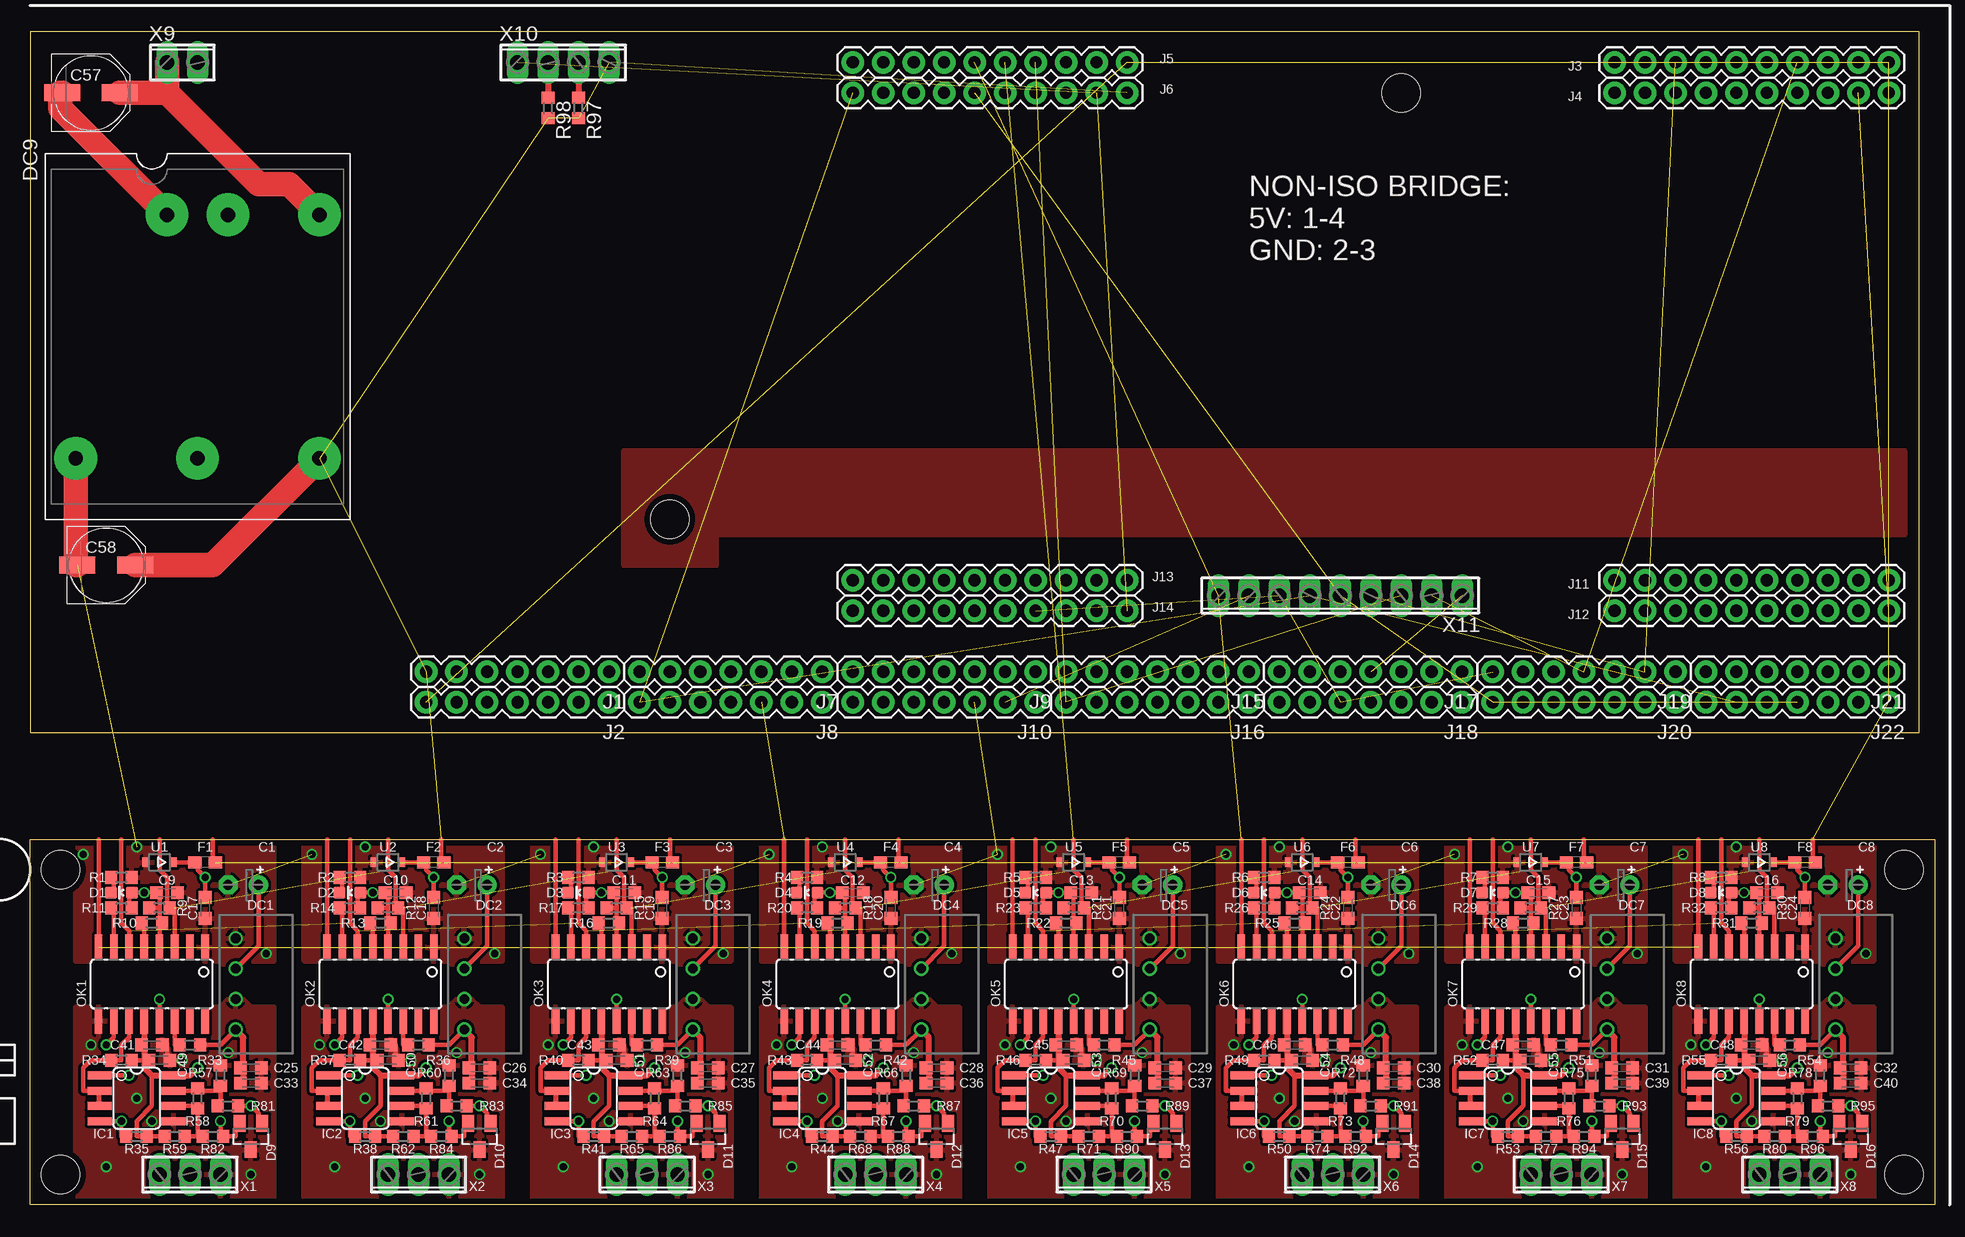
[diagram p6: board, top side]
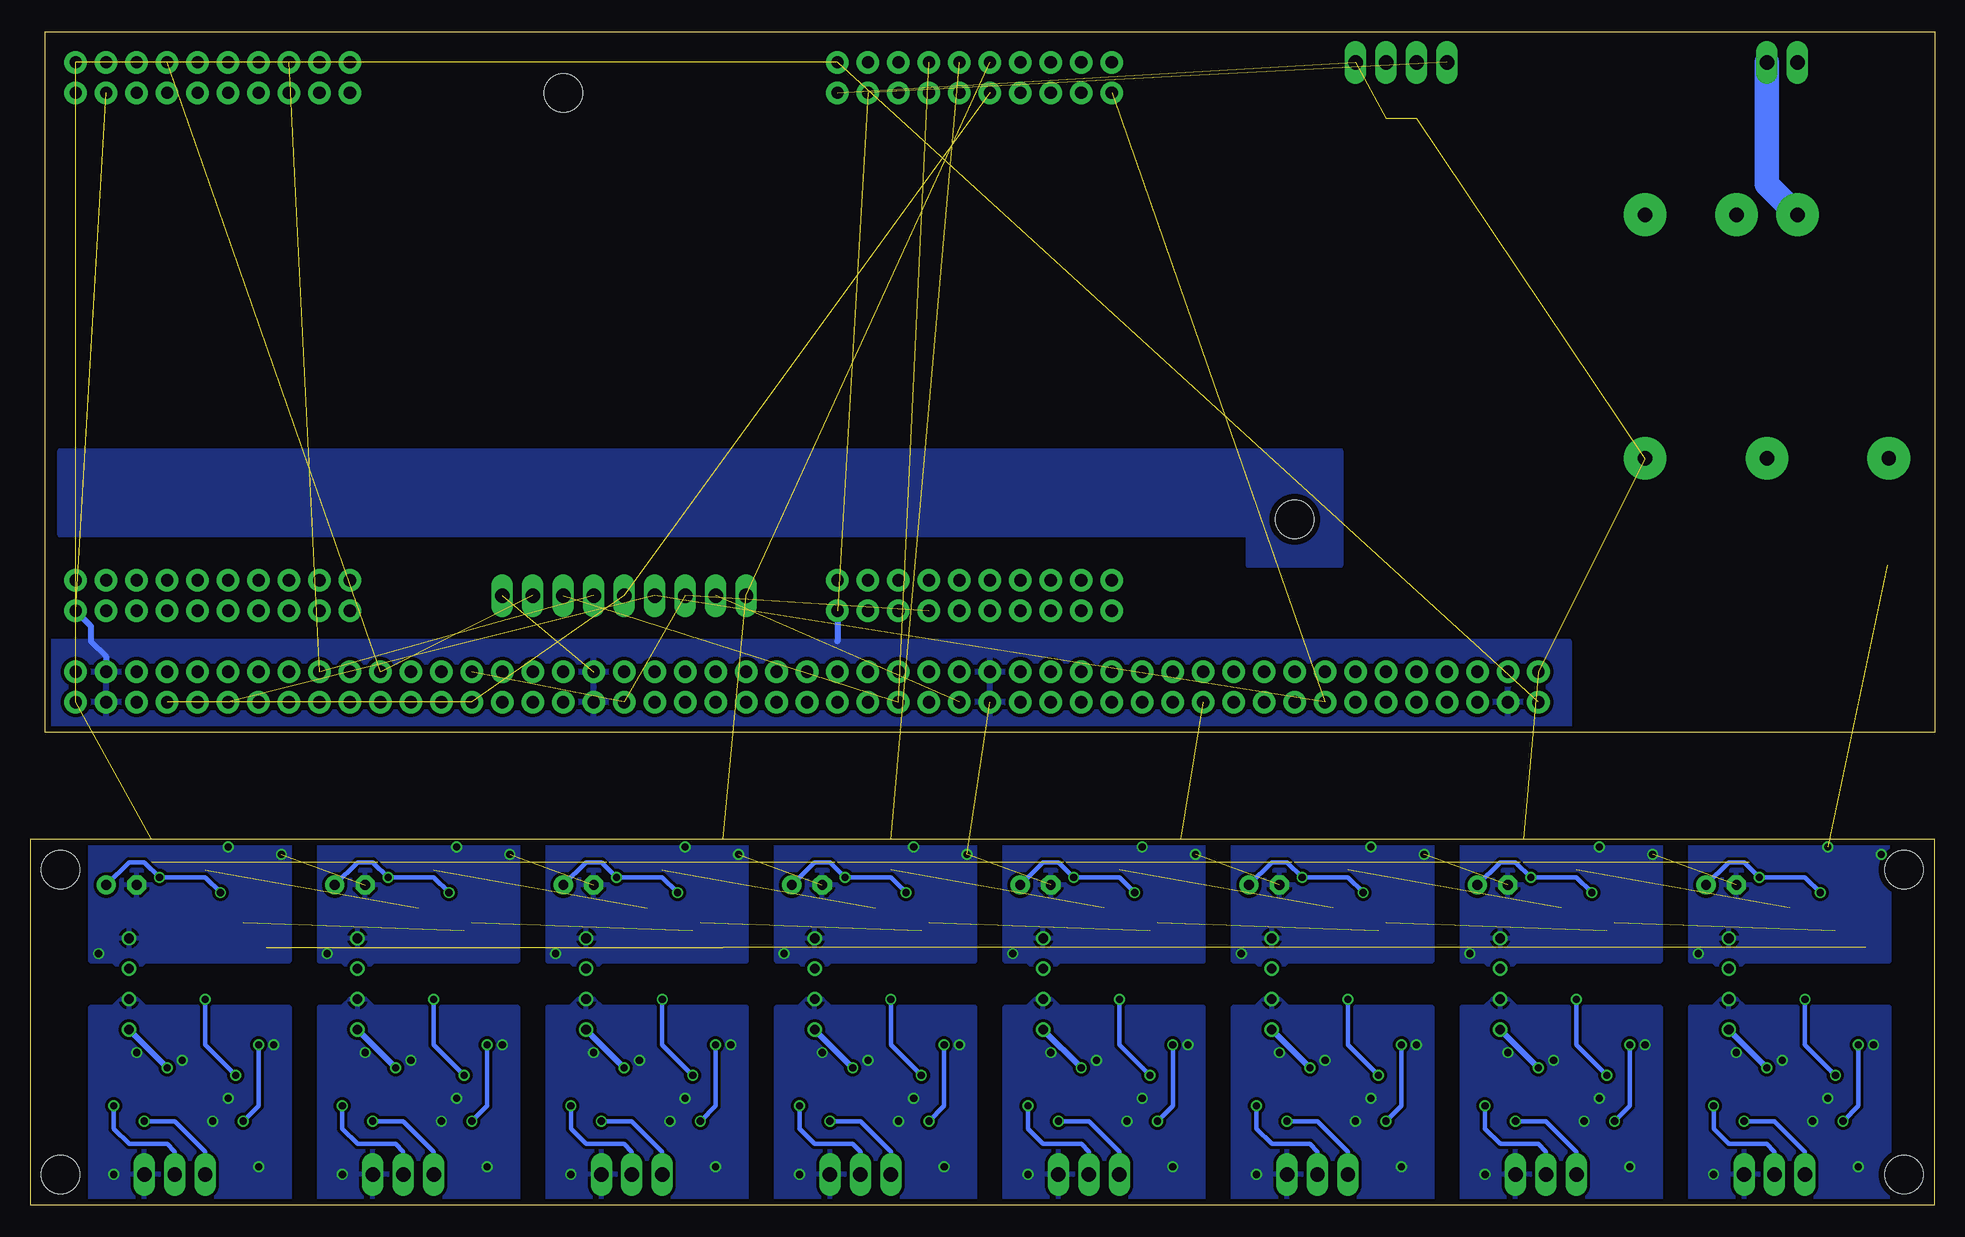
[diagram p7: board, bottom side, seen from below]

Size 158.75 x 97.79 mm. Coordinates in mm from the lower left corner, seen from the top.
Outline: 0,39.37 157.48,39.37 157.48,97.79 0,97.79 0,39.37
Outline: 0,0 0,30.48 158.75,30.48 158.75,0 0,0
Copper layers (1*16): Top 0.035mm / dielectric 1.6mm / Bottom 0.035mm
Design rules "Elecrow_2-layer_PCB_eagle_rule": minimum track width 6mil, minimum drill 12mil, track to track 6mil, track to pad 6mil, pad to pad 6mil, via to via 8mil, smd to smd 0mil, copper to edge 20mil, drill to drill 10mil, minimum pad ring 6mil, minimum via ring 6mil, stop-mask expansion 0mil, vias tented up to drill 100mil, thermal gap 10mil
Holes 3.17 mm at 114.3,92.71 53.34,57.15 156.21,27.94 156.21,2.54 2.54,27.94 2.54,2.54

### Footprints (pad centres in the part's own frame; a part is rotated, then mirrored left to right if it is on the bottom)
E2,5-5-NOSILK = drill 0.813 pad 1.6: + -1.27,0 | drill 0.813 pad 1.6 octagon: - 1.27,0
C0603K = smd 1.05 x 1.08: 1 -0.875,0; 2 0.875,0
PANASONIC_D = smd 3 x 1.4: + 2.4,0; - -2.4,0
LED-0603 = smd 1 x 1: A 0,-0.877; C 0,0.877
SOT23 = smd 1 x 1.4: 1 -0.95,-1.1; 2 0.95,-1.1; 3 0,1.1
4SIL = drill 0.8: 1 -3.81,0; 2 -1.27,0; 3 1.27,0; 4 3.81,0
SHHD003A0A = drill 1.2 pad 3.556: 1 -10.16,-2.54; 2 -10.16,2.54; 3 -10.16,10.16; 4 10.16,10.16; 5 10.16,0; 6 10.16,-10.16
0603 = smd 1.1 x 1: 1 -0.85,0; 2 0.85,0
SO08 = smd 0.66 x 2.032: 1 -1.905,-3.073; 2 -0.635,-3.073; 3 0.635,-3.073; 4 1.905,-3.073; 5 1.905,3.073; 6 0.635,3.073; 7 -0.635,3.073; 8 -1.905,3.073
1X07 = drill 1.016 pad 1.88: 1 0,0; 2 2.54,0; 3 5.08,0; 4 7.62,0; 5 10.16,0; 6 12.7,0; 7 15.24,0
1X10 = drill 1.016 pad 1.88: 1 0,0; 2 2.54,0; 3 5.08,0; 4 7.62,0; 5 10.16,0; 6 12.7,0; 7 15.24,0; 8 17.78,0; 9 20.32,0; 10 22.86,0
SO-16 = smd 0.635 x 2.159: 1 -4.445,-3.073; 2 -3.175,-3.073; 3 -1.905,-3.073; 4 -0.635,-3.073; 5 0.635,-3.073; 6 1.905,-3.073; 7 3.175,-3.073; 8 4.445,-3.073; 9 4.445,3.073; 10 3.175,3.073; 11 1.905,3.073; 12 0.635,3.073; 13 -0.635,3.073; 14 -1.905,3.073; 15 -3.175,3.073; 16 -4.445,3.073
R0603 = smd 1 x 1.1: 1 -0.85,0; 2 0.85,0
SOD323-NOSILK = smd 0.63 x 0.83: A 1.125,0; C -1.125,0
3POL254 = drill 1.2 long: 1 -2.54,0; 2 0,0; 3 2.54,0
2POL254 = drill 1.2 long: 1 -1.27,0; 2 1.27,0
4POL254 = drill 1.2 long: 1 -3.81,0; 2 -1.27,0; 3 1.27,0; 4 3.81,0
9POL254 = drill 1.2 long: 1 -10.16,0; 2 -7.62,0; 3 -5.08,0; 4 -2.54,0; 5 0,0; 6 2.54,0; 7 5.08,0; 8 7.62,0; 9 10.16,0

### Placement (x,y rotation side)
C1  17.78,26.67 180 top
C2  36.83,26.67 180 top
C3  55.88,26.67 180 top
C4  74.93,26.67 180 top
C5  93.98,26.67 180 top
C6  113.03,26.67 180 top
C7  132.08,26.67 180 top
C8  151.13,26.67 180 top
C9  11.43,26.04 0 top
C10  30.48,26.04 0 top
C11  49.53,26.04 0 top
C12  68.58,26.04 0 top
C13  87.63,26.04 0 top
C14  106.68,26.04 0 top
C15  125.73,26.04 0 top
C16  144.78,26.04 0 top
C17  14.61,24.77 270 top
C18  33.66,24.77 270 top
C19  52.7,24.77 270 top
C20  71.75,24.77 270 top
C21  90.81,24.77 270 top
C22  109.86,24.77 270 top
C23  128.91,24.77 270 top
C24  147.96,24.77 270 top
C25  18.41,11.43 0 top
C26  37.47,11.43 0 top
C27  56.52,11.43 0 top
C28  75.56,11.43 0 top
C29  94.61,11.43 0 top
C30  113.67,11.43 0 top
C31  132.72,11.43 0 top
C32  151.76,11.43 0 top
C33  18.41,10.16 0 top
C34  37.47,10.16 0 top
C35  56.52,10.16 0 top
C36  75.56,10.16 0 top
C37  94.61,10.16 0 top
C38  113.67,10.16 0 top
C39  132.72,10.16 0 top
C40  151.76,10.16 0 top
C41  10.16,13.34 0 top
C42  29.21,13.34 0 top
C43  48.26,13.34 0 top
C44  67.31,13.34 0 top
C45  86.36,13.34 0 top
C46  105.41,13.34 0 top
C47  124.46,13.34 0 top
C48  143.51,13.34 0 top
C49  10.79,12.06 0 top
C50  29.84,12.06 0 top
C51  48.9,12.06 0 top
C52  67.94,12.06 0 top
C53  87,12.06 0 top
C54  106.05,12.06 0 top
C55  125.09,12.06 0 top
C56  144.15,12.06 0 top
C57  5.08,92.71 0 top
C58  6.35,53.34 0 top
D1  7.62,26.04 90 top
D2  26.67,26.04 90 top
D3  45.72,26.04 90 top
D4  64.77,26.04 90 top
D5  83.82,26.04 90 top
D6  102.87,26.04 90 top
D7  121.92,26.04 90 top
D8  140.97,26.04 90 top
D9  18.41,5.71 180 top
D10  37.47,5.71 180 top
D11  56.52,5.71 180 top
D12  75.56,5.71 180 top
D13  94.61,5.71 180 top
D14  113.67,5.71 180 top
D15  132.72,5.71 180 top
D16  151.76,5.71 180 top
DC1  17.14,18.41 270 top
DC2  36.2,18.41 270 top
DC3  55.24,18.41 270 top
DC4  74.3,18.41 270 top
DC5  93.34,18.41 270 top
DC6  112.39,18.41 270 top
DC7  131.44,18.41 270 top
DC8  150.5,18.41 270 top
DC9  13.97,72.39 270 top
F1  14.61,28.57 180 top
F2  33.66,28.57 180 top
F3  52.7,28.57 180 top
F4  71.75,28.57 180 top
F5  90.81,28.57 180 top
F6  109.86,28.57 180 top
F7  128.91,28.57 180 top
F8  147.96,28.57 180 top
IC1  8.89,8.89 270 top
IC2  27.94,8.89 270 top
IC3  46.99,8.89 270 top
IC4  66.04,8.89 270 top
IC5  85.09,8.89 270 top
IC6  104.14,8.89 270 top
IC7  123.19,8.89 270 top
IC8  142.24,8.89 270 top
J1  48.26,44.45 180 top
J2  48.26,41.91 180 top
J3  154.94,95.25 180 top
J4  154.94,92.71 180 top
J5  91.44,95.25 180 top
J6  91.44,92.71 180 top
J7  66.04,44.45 180 top
J8  66.04,41.91 180 top
J9  83.82,44.45 180 top
J10  83.82,41.91 180 top
J11  154.94,52.07 180 top
J12  154.94,49.53 180 top
J13  91.44,52.07 180 top
J14  91.44,49.53 180 top
J15  101.6,44.45 180 top
J16  101.6,41.91 180 top
J17  119.38,44.45 180 top
J18  119.38,41.91 180 top
J19  137.16,44.45 180 top
J20  137.16,41.91 180 top
J21  154.94,44.45 180 top
J22  154.94,41.91 180 top
OK1  10.16,18.41 180 top
OK2  29.21,18.41 180 top
OK3  48.26,18.41 180 top
OK4  67.31,18.41 180 top
OK5  86.36,18.41 180 top
OK6  105.41,18.41 180 top
OK7  124.46,18.41 180 top
OK8  143.51,18.41 180 top
R1  7.62,27.3 0 top
R2  26.67,27.3 0 top
R3  45.72,27.3 0 top
R4  64.77,27.3 0 top
R5  83.82,27.3 0 top
R6  102.87,27.3 0 top
R7  121.92,27.3 0 top
R8  140.97,27.3 0 top
R9  10.79,24.77 0 top
R10  10.16,23.5 0 top
R11  7.62,24.77 0 top
R12  29.84,24.77 0 top
R13  29.21,23.5 0 top
R14  26.67,24.77 0 top
R15  48.9,24.77 0 top
R16  48.26,23.5 0 top
R17  45.72,24.77 0 top
R18  67.94,24.77 0 top
R19  67.31,23.5 0 top
R20  64.77,24.77 0 top
R21  87,24.77 0 top
R22  86.36,23.5 0 top
R23  83.82,24.77 0 top
R24  106.05,24.77 0 top
R25  105.41,23.5 0 top
R26  102.87,24.77 0 top
R27  125.09,24.77 0 top
R28  124.46,23.5 0 top
R29  121.92,24.77 0 top
R30  144.15,24.77 0 top
R31  143.51,23.5 0 top
R32  140.97,24.77 0 top
R33  13.34,13.34 180 top
R34  7.62,12.06 180 top
R35  8.89,5.71 180 top
R36  32.38,13.34 180 top
R37  26.67,12.06 180 top
R38  27.94,5.71 180 top
R39  51.44,13.34 180 top
R40  45.72,12.06 180 top
R41  46.99,5.71 180 top
R42  70.48,13.34 180 top
R43  64.77,12.06 180 top
R44  66.04,5.71 180 top
R45  89.53,13.34 180 top
R46  83.82,12.06 180 top
R47  85.09,5.71 180 top
R48  108.58,13.34 180 top
R49  102.87,12.06 180 top
R50  104.14,5.71 180 top
R51  127.64,13.34 180 top
R52  121.92,12.06 180 top
R53  123.19,5.71 180 top
R54  146.69,13.34 180 top
R55  140.97,12.06 180 top
R56  142.24,5.71 180 top
R57  15.88,10.79 270 top
R58  13.97,8.89 270 top
R59  12.06,5.71 180 top
R60  34.92,10.79 270 top
R61  33.02,8.89 270 top
R62  31.11,5.71 180 top
R63  53.98,10.79 270 top
R64  52.07,8.89 270 top
R65  50.16,5.71 180 top
R66  73.03,10.79 270 top
R67  71.12,8.89 270 top
R68  69.22,5.71 180 top
R69  92.08,10.79 270 top
R70  90.17,8.89 270 top
R71  88.27,5.71 180 top
R72  111.12,10.79 270 top
R73  109.22,8.89 270 top
R74  107.31,5.71 180 top
R75  130.18,10.79 270 top
R76  128.27,8.89 270 top
R77  126.36,5.71 180 top
R78  149.22,10.79 270 top
R79  147.32,8.89 270 top
R80  145.41,5.71 180 top
R81  16.51,8.26 0 top
R82  15.24,5.71 0 top
R83  35.56,8.26 0 top
R84  34.29,5.71 0 top
R85  54.61,8.26 0 top
R86  53.34,5.71 0 top
R87  73.66,8.26 0 top
R88  72.39,5.71 0 top
R89  92.71,8.26 0 top
R90  91.44,5.71 0 top
R91  111.76,8.26 0 top
R92  110.49,5.71 0 top
R93  130.81,8.26 0 top
R94  129.54,5.71 0 top
R95  149.86,8.26 0 top
R96  148.59,5.71 0 top
R97  45.72,91.44 270 top
R98  43.18,91.44 270 top
U1  10.79,28.57 180 top
U2  29.84,28.57 180 top
U3  48.9,28.57 180 top
U4  67.94,28.57 180 top
U5  87,28.57 180 top
U6  106.05,28.57 180 top
U7  125.09,28.57 180 top
U8  144.15,28.57 180 top
X1  13.34,2.54 180 top
X2  32.38,2.54 180 top
X3  51.44,2.54 180 top
X4  70.48,2.54 180 top
X5  89.53,2.54 180 top
X6  108.58,2.54 180 top
X7  127.64,2.54 180 top
X8  146.69,2.54 180 top
X9  12.7,95.25 0 top
X10  44.45,95.25 0 top
X11  109.22,50.8 180 top

### Tracks (layer width: path | path; a pad name or v marks a point on that pad's centre or on a via)
5V  (15 unrouted)
  Top 0.356: F1.1 15.24,28.57 15.24,30.48 | F2.1 34.29,28.57 34.29,30.48 | F3.1 53.34,28.57 53.34,30.48 | F4.1 72.39,28.57 72.39,30.48 | F5.1 91.44,28.57 91.44,30.48 | F6.1 110.49,28.57 110.49,30.48 | F7.1 129.54,28.57 129.54,30.48 | F8.1 148.59,28.57 148.59,30.48
  Top 2.032: DC9.4 15.24,53.34 C58.+
+3V3  (3 unrouted)
+5V
  pour Top (isolate 0.305): 156.21,62.87 156.21,55.88 57.15,55.88 57.15,53.34 49.53,53.34 49.53,62.87
+5V-ISO1  (via drill 0.6)
  Top 0.356: 9.53,12.06 R34.1 | R33.1 15.88,13.34 DC1.4 | R59.2 R35.1 8.89,5.71 8.89,6.99 10.16,8.26 10.16,10.79
  Top 0.508: 17.78,11.43 17.78,10.16 C33.1 | C25.1 17.78,11.43 | 17.78,11.43 17.78,13.97 DC1.4 | OK1.12 9.53,13.34 | C41.1 9.53,13.34 | 9.53,13.34 9.53,12.06 | C49.1 9.53,12.06 | 9.53,12.06 9.53,11.43 10.16,10.79 IC1.8 13.34,10.79 v13.97,11.43
  Bottom 0.508: v13.97,11.43 DC1.4
+5V-ISO2  (via drill 0.6)
  Top 0.356: 28.57,12.06 R37.1 | R36.1 34.92,13.34 DC2.4 | R62.2 R38.1 27.94,5.71 27.94,6.99 29.21,8.26 29.21,10.79
  Top 0.508: 36.83,11.43 36.83,10.16 C34.1 | C26.1 36.83,11.43 | 36.83,11.43 36.83,13.97 DC2.4 | OK2.12 28.57,13.34 | C42.1 28.57,13.34 | 28.57,13.34 28.57,12.06 | C50.1 28.57,12.06 | 28.57,12.06 28.57,11.43 29.21,10.79 IC2.8 32.38,10.79 v33.02,11.43
  Bottom 0.508: v33.02,11.43 DC2.4
+5V-ISO3  (via drill 0.6)
  Top 0.356: 47.62,12.06 R40.1 | R39.1 53.98,13.34 DC3.4 | R65.2 R41.1 46.99,5.71 46.99,6.99 48.26,8.26 48.26,10.79
  Top 0.508: 55.88,11.43 55.88,10.16 C35.1 | C27.1 55.88,11.43 | 55.88,11.43 55.88,13.97 DC3.4 | OK3.12 47.62,13.34 | C43.1 47.62,13.34 | 47.62,13.34 47.62,12.06 | C51.1 47.62,12.06 | 47.62,12.06 47.62,11.43 48.26,10.79 IC3.8 51.44,10.79 v52.07,11.43
  Bottom 0.508: v52.07,11.43 DC3.4
+5V-ISO4  (via drill 0.6)
  Top 0.356: 66.67,12.06 R43.1 | R42.1 73.03,13.34 DC4.4 | R68.2 R44.1 66.04,5.71 66.04,6.99 67.31,8.26 67.31,10.79
  Top 0.508: 74.93,11.43 74.93,10.16 C36.1 | C28.1 74.93,11.43 | 74.93,11.43 74.93,13.97 DC4.4 | OK4.12 66.67,13.34 | C44.1 66.67,13.34 | 66.67,13.34 66.67,12.06 | C52.1 66.67,12.06 | 66.67,12.06 66.67,11.43 67.31,10.79 IC4.8 70.48,10.79 v71.12,11.43
  Bottom 0.508: v71.12,11.43 DC4.4
+5V-ISO5  (via drill 0.6)
  Top 0.356: 85.72,12.06 R46.1 | R45.1 92.08,13.34 DC5.4 | R71.2 R47.1 85.09,5.71 85.09,6.99 86.36,8.26 86.36,10.79
  Top 0.508: 93.98,11.43 93.98,10.16 C37.1 | C29.1 93.98,11.43 | 93.98,11.43 93.98,13.97 DC5.4 | OK5.12 85.72,13.34 | C45.1 85.72,13.34 | 85.72,13.34 85.72,12.06 | C53.1 85.72,12.06 | 85.72,12.06 85.72,11.43 86.36,10.79 IC5.8 89.53,10.79 v90.17,11.43
  Bottom 0.508: v90.17,11.43 DC5.4
+5V-ISO6  (via drill 0.6)
  Top 0.356: 104.78,12.06 R49.1 | R48.1 111.12,13.34 DC6.4 | R74.2 R50.1 104.14,5.71 104.14,6.99 105.41,8.26 105.41,10.79
  Top 0.508: 113.03,11.43 113.03,10.16 C38.1 | C30.1 113.03,11.43 | 113.03,11.43 113.03,13.97 DC6.4 | OK6.12 104.78,13.34 | C46.1 104.78,13.34 | 104.78,13.34 104.78,12.06 | C54.1 104.78,12.06 | 104.78,12.06 104.78,11.43 105.41,10.79 IC6.8 108.58,10.79 v109.22,11.43
  Bottom 0.508: v109.22,11.43 DC6.4
+5V-ISO7  (via drill 0.6)
  Top 0.356: 123.83,12.06 R52.1 | R51.1 130.18,13.34 DC7.4 | R77.2 R53.1 123.19,5.71 123.19,6.99 124.46,8.26 124.46,10.79
  Top 0.508: 132.08,11.43 132.08,10.16 C39.1 | C31.1 132.08,11.43 | 132.08,11.43 132.08,13.97 DC7.4 | OK7.12 123.83,13.34 | C47.1 123.83,13.34 | 123.83,13.34 123.83,12.06 | C55.1 123.83,12.06 | 123.83,12.06 123.83,11.43 124.46,10.79 IC7.8 127.64,10.79 v128.27,11.43
  Bottom 0.508: v128.27,11.43 DC7.4
+5V-ISO8  (via drill 0.6)
  Top 0.356: 142.88,12.06 R55.1 | R54.1 149.22,13.34 DC8.4 | R80.2 R56.1 142.24,5.71 142.24,6.99 143.51,8.26 143.51,10.79
  Top 0.508: 151.13,11.43 151.13,10.16 C40.1 | C32.1 151.13,11.43 | 151.13,11.43 151.13,13.97 DC8.4 | OK8.12 142.88,13.34 | C48.1 142.88,13.34 | 142.88,13.34 142.88,12.06 | C56.1 142.88,12.06 | 142.88,12.06 142.88,11.43 143.51,10.79 IC8.8 146.69,10.79 v147.32,11.43
  Bottom 0.508: v147.32,11.43 DC8.4
GND  (via drill 0.6)  (13 unrouted)
  Top 2.032: DC9.6 3.81,53.34 C58.-
  Bottom 0.508: J12.1 153.67,48.26 153.67,46.99 152.4,45.72 J21.2 | J14.1 91.44,46.99
  other vias: 4.45,29.21 8.89,29.84 19.68,20.95 23.5,29.21 27.94,29.84 38.73,20.95 42.55,29.21 46.99,29.84 57.78,20.95 61.59,29.21 66.04,29.84 76.83,20.95 80.64,29.21 85.09,29.84 95.89,20.95 99.69,29.21 104.14,29.84 114.94,20.95 118.75,29.21 123.19,29.84 133.99,20.95 137.79,29.21 142.24,29.84 153.03,20.95
  pour Bottom (isolate 0.305): 49.53,62.87 49.53,53.34 57.15,53.34 57.15,55.88 156.21,55.88 156.21,62.87
  pour Bottom (isolate 0.305): 30.48,46.99 30.48,39.37 157.48,39.37 157.48,46.99
  pour Top (isolate 0.254): 20.32,30.48 20.32,20.32 18.41,20.32 17.78,19.68 16.51,19.68 15.88,20.32 3.81,20.32 3.81,30.48
  pour Bottom (isolate 0.254): 3.81,20.32 15.88,20.32 16.51,19.68 17.78,19.68 18.41,20.32 20.32,20.32 20.32,30.48 3.81,30.48
  pour Top (isolate 0.254): 39.37,30.48 39.37,20.32 37.47,20.32 36.83,19.68 35.56,19.68 34.92,20.32 22.86,20.32 22.86,30.48
  pour Bottom (isolate 0.254): 22.86,20.32 34.92,20.32 35.56,19.68 36.83,19.68 37.47,20.32 39.37,20.32 39.37,30.48 22.86,30.48
  pour Top (isolate 0.254): 58.42,30.48 58.42,20.32 56.52,20.32 55.88,19.68 54.61,19.68 53.98,20.32 41.91,20.32 41.91,30.48
  pour Bottom (isolate 0.254): 41.91,20.32 53.98,20.32 54.61,19.68 55.88,19.68 56.52,20.32 58.42,20.32 58.42,30.48 41.91,30.48
  pour Top (isolate 0.254): 77.47,30.48 77.47,20.32 75.56,20.32 74.93,19.68 73.66,19.68 73.03,20.32 60.96,20.32 60.96,30.48
  pour Bottom (isolate 0.254): 60.96,20.32 73.03,20.32 73.66,19.68 74.93,19.68 75.56,20.32 77.47,20.32 77.47,30.48 60.96,30.48
  pour Top (isolate 0.254): 96.52,30.48 96.52,20.32 94.61,20.32 93.98,19.68 92.71,19.68 92.08,20.32 80.01,20.32 80.01,30.48
  pour Bottom (isolate 0.254): 80.01,20.32 92.08,20.32 92.71,19.68 93.98,19.68 94.61,20.32 96.52,20.32 96.52,30.48 80.01,30.48
  pour Top (isolate 0.254): 115.57,30.48 115.57,20.32 113.67,20.32 113.03,19.68 111.76,19.68 111.12,20.32 99.06,20.32 99.06,30.48
  pour Bottom (isolate 0.254): 99.06,20.32 111.12,20.32 111.76,19.68 113.03,19.68 113.67,20.32 115.57,20.32 115.57,30.48 99.06,30.48
  pour Top (isolate 0.254): 134.62,30.48 134.62,20.32 132.72,20.32 132.08,19.68 130.81,19.68 130.18,20.32 118.11,20.32 118.11,30.48
  pour Bottom (isolate 0.254): 118.11,20.32 130.18,20.32 130.81,19.68 132.08,19.68 132.72,20.32 134.62,20.32 134.62,30.48 118.11,30.48
  pour Top (isolate 0.254): 153.67,30.48 153.67,20.32 151.76,20.32 151.13,19.68 149.86,19.68 149.22,20.32 137.16,20.32 137.16,30.48
  pour Bottom (isolate 0.254): 137.16,20.32 149.22,20.32 149.86,19.68 151.13,19.68 151.76,20.32 153.67,20.32 153.67,30.48 137.16,30.48
GND-ISO1  (via drill 0.6)
  Top 0.356: C41.2 11.43,13.34 11.43,12.3 C49.2
  other vias: 12.7,12.06 10.16,6.99 16.51,12.7 8.89,8.89 5.08,13.34 18.41,2.54 6.35,3.17
  pour Top (isolate 0.254): 20.32,0 3.81,0 3.81,16.51 15.88,16.51 16.51,17.14 17.78,17.14 18.41,16.51 20.32,16.51
  pour Bottom (isolate 0.254): 20.32,16.51 18.41,16.51 17.78,17.14 16.51,17.14 15.88,16.51 3.81,16.51 3.81,0 20.32,0
GND-ISO2  (via drill 0.6)
  Top 0.356: C42.2 30.48,13.34 30.48,12.3 C50.2
  other vias: 31.75,12.06 29.21,6.99 35.56,12.7 27.94,8.89 24.13,13.34 37.47,2.54 25.4,3.17
  pour Top (isolate 0.254): 39.37,0 22.86,0 22.86,16.51 34.92,16.51 35.56,17.14 36.83,17.14 37.47,16.51 39.37,16.51
  pour Bottom (isolate 0.254): 39.37,16.51 37.47,16.51 36.83,17.14 35.56,17.14 34.92,16.51 22.86,16.51 22.86,0 39.37,0
GND-ISO3  (via drill 0.6)
  Top 0.356: C43.2 49.53,13.34 49.53,12.3 C51.2
  other vias: 50.8,12.06 48.26,6.99 54.61,12.7 46.99,8.89 43.18,13.34 56.52,2.54 44.45,3.17
  pour Top (isolate 0.254): 58.42,0 41.91,0 41.91,16.51 53.98,16.51 54.61,17.14 55.88,17.14 56.52,16.51 58.42,16.51
  pour Bottom (isolate 0.254): 58.42,16.51 56.52,16.51 55.88,17.14 54.61,17.14 53.98,16.51 41.91,16.51 41.91,0 58.42,0
GND-ISO4  (via drill 0.6)
  Top 0.356: C44.2 68.58,13.34 68.58,12.3 C52.2
  other vias: 69.85,12.06 67.31,6.99 73.66,12.7 66.04,8.89 62.23,13.34 75.56,2.54 63.5,3.17
  pour Top (isolate 0.254): 77.47,0 60.96,0 60.96,16.51 73.03,16.51 73.66,17.14 74.93,17.14 75.56,16.51 77.47,16.51
  pour Bottom (isolate 0.254): 77.47,16.51 75.56,16.51 74.93,17.14 73.66,17.14 73.03,16.51 60.96,16.51 60.96,0 77.47,0
GND-ISO5  (via drill 0.6)
  Top 0.356: C45.2 87.63,13.34 87.63,12.3 C53.2
  other vias: 88.9,12.06 86.36,6.99 92.71,12.7 85.09,8.89 81.28,13.34 94.61,2.54 82.55,3.17
  pour Top (isolate 0.254): 96.52,0 80.01,0 80.01,16.51 92.08,16.51 92.71,17.14 93.98,17.14 94.61,16.51 96.52,16.51
  pour Bottom (isolate 0.254): 96.52,16.51 94.61,16.51 93.98,17.14 92.71,17.14 92.08,16.51 80.01,16.51 80.01,0 96.52,0
GND-ISO6  (via drill 0.6)
  Top 0.356: C46.2 106.68,13.34 106.68,12.3 C54.2
  other vias: 107.95,12.06 105.41,6.99 111.76,12.7 104.14,8.89 100.33,13.34 113.67,2.54 101.6,3.17
  pour Top (isolate 0.254): 115.57,0 99.06,0 99.06,16.51 111.12,16.51 111.76,17.14 113.03,17.14 113.67,16.51 115.57,16.51
  pour Bottom (isolate 0.254): 115.57,16.51 113.67,16.51 113.03,17.14 111.76,17.14 111.12,16.51 99.06,16.51 99.06,0 115.57,0
GND-ISO7  (via drill 0.6)
  Top 0.356: C47.2 125.73,13.34 125.73,12.3 C55.2
  other vias: 127,12.06 124.46,6.99 130.81,12.7 123.19,8.89 119.38,13.34 132.72,2.54 120.65,3.17
  pour Top (isolate 0.254): 134.62,0 118.11,0 118.11,16.51 130.18,16.51 130.81,17.14 132.08,17.14 132.72,16.51 134.62,16.51
  pour Bottom (isolate 0.254): 134.62,16.51 132.72,16.51 132.08,17.14 130.81,17.14 130.18,16.51 118.11,16.51 118.11,0 134.62,0
GND-ISO8  (via drill 0.6)
  Top 0.356: C48.2 144.78,13.34 144.78,12.3 C56.2
  other vias: 146.05,12.06 143.51,6.99 149.86,12.7 142.24,8.89 138.43,13.34 151.76,2.54 139.7,3.17
  pour Top (isolate 0.254): 153.67,0 137.16,0 137.16,16.51 149.22,16.51 149.86,17.14 151.13,17.14 151.76,16.51 153.67,16.51
  pour Bottom (isolate 0.254): 153.67,16.51 151.76,16.51 151.13,17.14 149.86,17.14 149.22,16.51 137.16,16.51 137.16,0 153.67,0
I2C0-SCL
  Top 0.508: X10.2 R98.1
I2C0-SDA
  Top 0.508: X10.3 R97.1
N$1
  Top 0.356: R60.2 34.92,9.53 | 34.92,9.53 33.02,9.53 | IC2.7 33.02,9.53 | 33.02,9.53 R61.1 | 34.92,9.53 34.92,8.47 R83.1
N$2
  Top 0.356: R57.2 15.88,9.53 | 15.88,9.53 13.97,9.53 | IC1.7 13.97,9.53 | 13.97,9.53 R58.1 | 15.88,9.53 15.88,8.47 R81.1
N$3
  Top 0.356: IC1.6 13.97,8.26 R58.2 13.97,5.71 R82.1 R59.1
N$4
  Top 0.356: IC2.6 33.02,8.26 R61.2 33.02,5.71 R84.1 R62.1
N$5  (via drill 0.6)
  Top 0.356: OK2.13 v29.84,17.14 | v27.3,10.79 IC2.1
  Bottom 0.356: v29.84,17.14 29.84,13.34 v27.3,10.79
N$6
  Top 0.356: IC2.2 23.5,9.53 23.5,11.43 24.13,12.06 R37.2 26.67,12.06 26.67,13.34 27.3,13.97 OK2.11
  Top 0.406: IC2.2 24.77,9.53 24.77,8.36 IC2.3
N$7
  Top 0.356: OK2.5 28.57,23.5 R13.1
N$8
  Top 0.356: OK2.7 26.04,24.77 R14.1
N$9
  Top 0.356: OK2.14 31.11,13.34 R36.2
N$10  (via drill 0.6)
  Top 0.356: OK1.13 v10.79,17.14 | v8.26,10.79 IC1.1
  Bottom 0.356: v10.79,17.14 10.79,13.34 v8.26,10.79
N$11
  Top 0.356: R2.1 26.04,27.3 26.04,26.04 D2.C
N$12  (via drill 0.6)
  Top 0.356: D10.1 38.1,7.13 38.1,7.62 v37.47,8.26 R83.2
  Bottom 0.356: X2.2 32.38,4.45 33.02,5.08 36.2,5.08 37.47,6.35 v37.47,8.26
N$13  (via drill 0.6)
  Top 0.356: D10.2 36.34,6.99 36.2,6.99 36.2,5.71 R84.2 34.92,5.71 v34.92,6.99
  Bottom 0.356: v34.92,6.99 32.38,6.99 29.84,4.45 X2.3
N$14
  Top 0.356: R63.2 53.98,9.53 | 53.98,9.53 52.07,9.53 | IC3.7 52.07,9.53 | 52.07,9.53 R64.1 | 53.98,9.53 53.98,8.47 R85.1
N$15
  Top 0.356: IC3.6 52.07,8.26 R64.2 52.07,5.71 R86.1 R65.1
N$16  (via drill 0.6)
  Top 0.356: OK3.13 v48.9,17.14 | v46.35,10.79 IC3.1
  Bottom 0.356: v48.9,17.14 48.9,13.34 v46.35,10.79
N$17
  Top 0.356: IC3.2 42.55,9.53 42.55,11.43 43.18,12.06 R40.2 45.72,12.06 45.72,13.34 46.35,13.97 OK3.11
  Top 0.406: IC3.2 43.81,9.53 43.81,8.36 IC3.3
N$18
  Top 0.356: IC1.2 4.45,9.53 4.45,11.43 5.08,12.06 R34.2 7.62,12.06 7.62,13.34 8.26,13.97 OK1.11
  Top 0.406: IC1.2 5.71,9.53 5.71,8.36 IC1.3
N$19
  Top 0.356: OK1.5 9.53,23.5 R10.1
N$20
  Top 0.356: OK3.5 47.62,23.5 R16.1
N$21
  Top 0.356: OK1.7 6.99,24.77 R11.1
N$22
  Top 0.356: OK3.7 45.09,24.77 R17.1
N$23
  Top 0.356: OK1.14 12.06,13.34 R33.2
N$24
  Top 0.356: OK3.14 50.16,13.34 R39.2
N$25
  Top 0.356: R1.1 6.99,27.3 6.99,26.04 D1.C
N$26
  Top 0.356: R3.1 45.09,27.3 45.09,26.04 D3.C
N$27  (via drill 0.6)
  Top 0.356: D9.1 19.05,7.13 19.05,7.62 v18.41,8.26 R81.2
  Bottom 0.356: X1.2 13.34,4.45 13.97,5.08 17.14,5.08 18.41,6.35 v18.41,8.26
N$28  (via drill 0.6)
  Top 0.356: D9.2 17.3,6.99 17.14,6.99 17.14,5.71 R82.2 15.88,5.71 v15.88,6.99
  Bottom 0.356: v15.88,6.99 13.34,6.99 10.79,4.45 X1.3
N$29  (via drill 0.6)
  Top 0.356: D11.1 57.15,7.13 57.15,7.62 v56.52,8.26 R85.2
  Bottom 0.356: X3.2 51.44,4.45 52.07,5.08 55.24,5.08 56.52,6.35 v56.52,8.26
N$30  (via drill 0.6)
  Top 0.356: D11.2 55.4,6.99 55.24,6.99 55.24,5.71 R86.2 53.98,5.71 v53.98,6.99
  Bottom 0.356: v53.98,6.99 51.44,6.99 48.9,4.45 X3.3
N$31
  Top 0.356: R66.2 73.03,9.53 | 73.03,9.53 71.12,9.53 | IC4.7 71.12,9.53 | 71.12,9.53 R67.1 | 73.03,9.53 73.03,8.47 R87.1
N$32
  Top 2.032: C57.- 2.54,92.71 2.54,91.44 DC9.1
  Bottom 2.032: X9.2 13.97,85.09 DC9.1
N$33
  Top 0.356: IC4.6 71.12,8.26 R67.2 71.12,5.71 R88.1 R68.1
N$34
  Top 2.032: C57.+ 11.43,92.71 | 11.43,92.71 19.05,85.09 21.59,85.09 DC9.3 | X9.1 11.43,92.71
N$35  (via drill 0.6)
  Top 0.356: OK4.13 v67.94,17.14 | v65.41,10.79 IC4.1
  Bottom 0.356: v67.94,17.14 67.94,13.34 v65.41,10.79
N$36
  Top 0.356: IC4.2 61.59,9.53 61.59,11.43 62.23,12.06 R43.2 64.77,12.06 64.77,13.34 65.41,13.97 OK4.11
  Top 0.406: IC4.2 62.87,9.53 62.87,8.36 IC4.3
N$37
  Top 0.356: OK4.5 66.67,23.5 R19.1
N$38
  Top 0.356: OK4.7 64.14,24.77 R20.1
N$39
  Top 0.356: OK4.14 69.22,13.34 R42.2
N$40
  Top 0.356: R4.1 64.14,27.3 64.14,26.04 D4.C
N$41  (via drill 0.6)
  Top 0.356: D12.1 76.2,7.13 76.2,7.62 v75.56,8.26 R87.2
  Bottom 0.356: X4.2 70.48,4.45 71.12,5.08 74.3,5.08 75.56,6.35 v75.56,8.26
N$42  (via drill 0.6)
  Top 0.356: D12.2 74.44,6.99 74.3,6.99 74.3,5.71 R88.2 73.03,5.71 v73.03,6.99
  Bottom 0.356: v73.03,6.99 70.48,6.99 67.94,4.45 X4.3
N$43
  Top 0.356: R69.2 92.08,9.53 | 92.08,9.53 90.17,9.53 | IC5.7 90.17,9.53 | 90.17,9.53 R70.1 | 92.08,9.53 92.08,8.47 R89.1
N$44
  Top 0.356: IC5.6 90.17,8.26 R70.2 90.17,5.71 R90.1 R71.1
N$45  (via drill 0.6)
  Top 0.356: OK5.13 v87,17.14 | v84.45,10.79 IC5.1
  Bottom 0.356: v87,17.14 87,13.34 v84.45,10.79
N$46
  Top 0.356: IC5.2 80.64,9.53 80.64,11.43 81.28,12.06 R46.2 83.82,12.06 83.82,13.34 84.45,13.97 OK5.11
  Top 0.406: IC5.2 81.92,9.53 81.92,8.36 IC5.3
N$47
  Top 0.356: OK5.5 85.72,23.5 R22.1
N$48
  Top 0.356: OK5.7 83.19,24.77 R23.1
N$49
  Top 0.356: OK5.14 88.27,13.34 R45.2
N$50
  Top 0.356: R5.1 83.19,27.3 83.19,26.04 D5.C
N$51  (via drill 0.6)
  Top 0.356: D13.1 95.25,7.13 95.25,7.62 v94.61,8.26 R89.2
  Bottom 0.356: X5.2 89.53,4.45 90.17,5.08 93.34,5.08 94.61,6.35 v94.61,8.26
N$52  (via drill 0.6)
  Top 0.356: D13.2 93.5,6.99 93.34,6.99 93.34,5.71 R90.2 92.08,5.71 v92.08,6.99
  Bottom 0.356: v92.08,6.99 89.53,6.99 87,4.45 X5.3
N$53
  Top 0.356: R72.2 111.12,9.53 | 111.12,9.53 109.22,9.53 | IC6.7 109.22,9.53 | 109.22,9.53 R73.1 | 111.12,9.53 111.12,8.47 R91.1
N$54
  Top 0.356: IC6.6 109.22,8.26 R73.2 109.22,5.71 R92.1 R74.1
N$55  (via drill 0.6)
  Top 0.356: OK6.13 v106.05,17.14 | v103.5,10.79 IC6.1
  Bottom 0.356: v106.05,17.14 106.05,13.34 v103.5,10.79
N$56
  Top 0.356: IC6.2 99.69,9.53 99.69,11.43 100.33,12.06 R49.2 102.87,12.06 102.87,13.34 103.5,13.97 OK6.11
  Top 0.406: IC6.2 100.97,9.53 100.97,8.36 IC6.3
N$57
  Top 0.356: OK6.5 104.78,23.5 R25.1
N$58
  Top 0.356: OK6.7 102.23,24.77 R26.1
N$59
  Top 0.356: OK6.14 107.31,13.34 R48.2
N$60
  Top 0.356: R6.1 102.23,27.3 102.23,26.04 D6.C
N$61  (via drill 0.6)
  Top 0.356: D14.1 114.3,7.13 114.3,7.62 v113.67,8.26 R91.2
  Bottom 0.356: X6.2 108.58,4.45 109.22,5.08 112.39,5.08 113.67,6.35 v113.67,8.26
N$62  (via drill 0.6)
  Top 0.356: D14.2 112.55,6.99 112.39,6.99 112.39,5.71 R92.2 111.12,5.71 v111.12,6.99
  Bottom 0.356: v111.12,6.99 108.58,6.99 106.05,4.45 X6.3
N$63
  Top 0.356: R75.2 130.18,9.53 | 130.18,9.53 128.27,9.53 | IC7.7 128.27,9.53 | 128.27,9.53 R76.1 | 130.18,9.53 130.18,8.47 R93.1
N$64
  Top 0.356: IC7.6 128.27,8.26 R76.2 128.27,5.71 R94.1 R77.1
N$65  (via drill 0.6)
  Top 0.356: OK7.13 v125.09,17.14 | v122.56,10.79 IC7.1
  Bottom 0.356: v125.09,17.14 125.09,13.34 v122.56,10.79
N$66
  Top 0.356: IC7.2 118.75,9.53 118.75,11.43 119.38,12.06 R52.2 121.92,12.06 121.92,13.34 122.56,13.97 OK7.11
  Top 0.406: IC7.2 120.02,9.53 120.02,8.36 IC7.3
N$67
  Top 0.356: OK7.5 123.83,23.5 R28.1
N$68
  Top 0.356: OK7.7 121.28,24.77 R29.1
N$69
  Top 0.356: OK7.14 126.36,13.34 R51.2
N$70
  Top 0.356: R7.1 121.28,27.3 121.28,26.04 D7.C
N$71  (via drill 0.6)
  Top 0.356: D15.1 133.35,7.13 133.35,7.62 v132.72,8.26 R93.2
  Bottom 0.356: X7.2 127.64,4.45 128.27,5.08 131.44,5.08 132.72,6.35 v132.72,8.26
N$72  (via drill 0.6)
  Top 0.356: D15.2 131.59,6.99 131.44,6.99 131.44,5.71 R94.2 130.18,5.71 v130.18,6.99
  Bottom 0.356: v130.18,6.99 127.64,6.99 125.09,4.45 X7.3
N$73
  Top 0.356: R78.2 149.22,9.53 | 149.22,9.53 147.32,9.53 | IC8.7 147.32,9.53 | 147.32,9.53 R79.1 | 149.22,9.53 149.22,8.47 R95.1
N$74
  Top 0.356: IC8.6 147.32,8.26 R79.2 147.32,5.71 R96.1 R80.1
N$75  (via drill 0.6)
  Top 0.356: OK8.13 v144.15,17.14 | v141.6,10.79 IC8.1
  Bottom 0.356: v144.15,17.14 144.15,13.34 v141.6,10.79
N$76
  Top 0.356: IC8.2 137.79,9.53 137.79,11.43 138.43,12.06 R55.2 140.97,12.06 140.97,13.34 141.6,13.97 OK8.11
  Top 0.406: IC8.2 139.06,9.53 139.06,8.36 IC8.3
N$77
  Top 0.356: OK8.5 142.88,23.5 R31.1
N$78
  Top 0.356: OK8.7 140.34,24.77 R32.1
N$79
  Top 0.356: OK8.14 145.41,13.34 R54.2
N$80
  Top 0.356: R8.1 140.34,27.3 140.34,26.04 D8.C
N$81  (via drill 0.6)
  Top 0.356: D16.1 152.4,7.13 152.4,7.62 v151.76,8.26 R95.2
  Bottom 0.356: X8.2 146.69,4.45 147.32,5.08 150.5,5.08 151.76,6.35 v151.76,8.26
N$82  (via drill 0.6)
  Top 0.356: D16.2 150.65,6.99 150.5,6.99 150.5,5.71 R96.2 149.22,5.71 v149.22,6.99
  Bottom 0.356: v149.22,6.99 146.69,6.99 144.15,4.45 X8.3
OPTO-OUT1  (via drill 0.6)
  Top 0.356: OK1.10 6.99,13.97 v6.35,13.34 | IC1.4 v7.62,6.99 7.62,5.71 R35.2
  Bottom 0.356: v6.35,13.34 6.35,8.26 v7.62,6.99
OPTO-OUT2  (via drill 0.6)
  Top 0.356: OK2.10 26.04,13.97 v25.4,13.34 | IC2.4 v26.67,6.99 26.67,5.71 R38.2
  Bottom 0.356: v25.4,13.34 25.4,8.26 v26.67,6.99
OPTO-OUT3  (via drill 0.6)
  Top 0.356: OK3.10 45.09,13.97 v44.45,13.34 | IC3.4 v45.72,6.99 45.72,5.71 R41.2
  Bottom 0.356: v44.45,13.34 44.45,8.26 v45.72,6.99
OPTO-OUT4  (via drill 0.6)
  Top 0.356: OK4.10 64.14,13.97 v63.5,13.34 | IC4.4 v64.77,6.99 64.77,5.71 R44.2
  Bottom 0.356: v63.5,13.34 63.5,8.26 v64.77,6.99
OPTO-OUT5  (via drill 0.6)
  Top 0.356: OK5.10 83.19,13.97 v82.55,13.34 | IC5.4 v83.82,6.99 83.82,5.71 R47.2
  Bottom 0.356: v82.55,13.34 82.55,8.26 v83.82,6.99
OPTO-OUT6  (via drill 0.6)
  Top 0.356: OK6.10 102.23,13.97 v101.6,13.34 | IC6.4 v102.87,6.99 102.87,5.71 R50.2
  Bottom 0.356: v101.6,13.34 101.6,8.26 v102.87,6.99
OPTO-OUT7  (via drill 0.6)
  Top 0.356: OK7.10 121.28,13.97 v120.65,13.34 | IC7.4 v121.92,6.99 121.92,5.71 R53.2
  Bottom 0.356: v120.65,13.34 120.65,8.26 v121.92,6.99
OPTO-OUT8  (via drill 0.6)
  Top 0.356: OK8.10 140.34,13.97 v139.7,13.34 | IC8.4 v140.97,6.99 140.97,5.71 R56.2
  Bottom 0.356: v139.7,13.34 139.7,8.26 v140.97,6.99
U0RX  (8 unrouted)
  Top 0.356: OK1.3 12.06,24.77 R9.2 11.43,24.77 11.43,27.3 10.79,27.94 10.79,30.48 | OK2.3 31.11,24.77 R12.2 30.48,24.77 30.48,27.3 29.84,27.94 29.84,30.48 | OK3.3 50.16,24.77 R15.2 49.53,24.77 49.53,27.3 48.9,27.94 48.9,30.48 | OK4.3 69.22,24.77 R18.2 68.58,24.77 68.58,27.3 67.94,27.94 67.94,30.48 | OK5.3 88.27,24.77 R21.2 87.63,24.77 87.63,27.3 87,27.94 87,30.48 | OK6.3 107.31,24.77 R24.2 106.68,24.77 106.68,27.3 106.05,27.94 106.05,30.48 | OK7.3 126.36,24.77 R27.2 125.73,24.77 125.73,27.3 125.09,27.94 125.09,30.48 | OK8.3 145.41,24.77 R30.2 144.78,24.77 144.78,27.3 144.15,27.94 144.15,30.48
U0SEL  (7 unrouted)
  Top 0.356: OK1.6 8.26,22.86 7.62,23.5 7.62,30.48 | OK2.6 27.3,22.86 26.67,23.5 26.67,30.48 | OK3.6 46.35,22.86 45.72,23.5 45.72,30.48 | OK4.6 65.41,22.86 64.77,23.5 64.77,30.48 | OK5.6 84.45,22.86 83.82,23.5 83.82,30.48 | OK6.6 103.5,22.86 102.87,23.5 102.87,30.48 | OK7.6 122.56,22.86 121.92,23.5 121.92,30.48 | OK8.6 141.6,22.86 140.97,23.5 140.97,30.48
U0TX  (10 unrouted)
  Top 0.356: OK1.8 5.71,30.48 | OK2.8 24.77,30.48 | OK3.8 43.81,30.48 | OK4.8 62.87,30.48 | OK5.8 81.92,30.48 | OK6.8 100.97,30.48 | OK7.8 120.02,30.48 | OK8.8 139.06,30.48
U1TX  (1 unrouted)
U2TX  (3 unrouted)
U3TX  (3 unrouted)
U4TX  (3 unrouted)
U5TX  (2 unrouted)
U6TX  (2 unrouted)
U7TX  (2 unrouted)
VIN-1  (via drill 0.6)
  Top 0.356: DC1.2 19.05,21.59 C1.+ | C17.1 v14.61,27.3 13.97,27.94 13.97,28.36 F1.2 U1.C | 10.79,24.77 10.79,26.04 C9.1 v9.53,26.04 D1.A 8.26,26.04 8.26,24.77 R11.2 | R10.2 10.79,23.5 | 10.79,23.5 OK1.4 | R9.1 10.79,24.77 | 10.79,24.77 10.79,23.5
  Bottom 0.356: v9.53,26.04 10.79,27.3 v14.61,27.3 15.88,28.57 17.14,28.57 C1.+
VIN-2  (via drill 0.6)
  Top 0.356: DC2.2 38.1,21.59 C2.+ | C18.1 v33.66,27.3 33.02,27.94 33.02,28.36 F2.2 U2.C | 29.84,24.77 29.84,26.04 C10.1 v28.57,26.04 D2.A 27.3,26.04 27.3,24.77 R14.2 | R13.2 29.84,23.5 | 29.84,23.5 OK2.4 | R12.1 29.84,24.77 | 29.84,24.77 29.84,23.5
  Bottom 0.356: v28.57,26.04 29.84,27.3 v33.66,27.3 34.92,28.57 36.2,28.57 C2.+
VIN-3  (via drill 0.6)
  Top 0.356: DC3.2 57.15,21.59 C3.+ | C19.1 v52.7,27.3 52.07,27.94 52.07,28.36 F3.2 U3.C | 48.9,24.77 48.9,26.04 C11.1 v47.62,26.04 D3.A 46.35,26.04 46.35,24.77 R17.2 | R16.2 48.9,23.5 | 48.9,23.5 OK3.4 | R15.1 48.9,24.77 | 48.9,24.77 48.9,23.5
  Bottom 0.356: v47.62,26.04 48.9,27.3 v52.7,27.3 53.98,28.57 55.24,28.57 C3.+
VIN-4  (via drill 0.6)
  Top 0.356: DC4.2 76.2,21.59 C4.+ | C20.1 v71.75,27.3 71.12,27.94 71.12,28.36 F4.2 U4.C | 67.94,24.77 67.94,26.04 C12.1 v66.67,26.04 D4.A 65.41,26.04 65.41,24.77 R20.2 | R19.2 67.94,23.5 | 67.94,23.5 OK4.4 | R18.1 67.94,24.77 | 67.94,24.77 67.94,23.5
  Bottom 0.356: v66.67,26.04 67.94,27.3 v71.75,27.3 73.03,28.57 74.3,28.57 C4.+
VIN-5  (via drill 0.6)
  Top 0.356: DC5.2 95.25,21.59 C5.+ | C21.1 v90.81,27.3 90.17,27.94 90.17,28.36 F5.2 U5.C | 87,24.77 87,26.04 C13.1 v85.72,26.04 D5.A 84.45,26.04 84.45,24.77 R23.2 | R22.2 87,23.5 | 87,23.5 OK5.4 | R21.1 87,24.77 | 87,24.77 87,23.5
  Bottom 0.356: v85.72,26.04 87,27.3 v90.81,27.3 92.08,28.57 93.34,28.57 C5.+
VIN-6  (via drill 0.6)
  Top 0.356: DC6.2 114.3,21.59 C6.+ | C22.1 v109.86,27.3 109.22,27.94 109.22,28.36 F6.2 U6.C | 106.05,24.77 106.05,26.04 C14.1 v104.78,26.04 D6.A 103.5,26.04 103.5,24.77 R26.2 | R25.2 106.05,23.5 | 106.05,23.5 OK6.4 | R24.1 106.05,24.77 | 106.05,24.77 106.05,23.5
  Bottom 0.356: v104.78,26.04 106.05,27.3 v109.86,27.3 111.12,28.57 112.39,28.57 C6.+
VIN-7  (via drill 0.6)
  Top 0.356: DC7.2 133.35,21.59 C7.+ | C23.1 v128.91,27.3 128.27,27.94 128.27,28.36 F7.2 U7.C | 125.09,24.77 125.09,26.04 C15.1 v123.83,26.04 D7.A 122.56,26.04 122.56,24.77 R29.2 | R28.2 125.09,23.5 | 125.09,23.5 OK7.4 | R27.1 125.09,24.77 | 125.09,24.77 125.09,23.5
  Bottom 0.356: v123.83,26.04 125.09,27.3 v128.91,27.3 130.18,28.57 131.44,28.57 C7.+
VIN-8  (via drill 0.6)
  Top 0.356: DC8.2 152.4,21.59 C8.+ | C24.1 v147.96,27.3 147.32,27.94 147.32,28.36 F8.2 U8.C | 144.15,24.77 144.15,26.04 C16.1 v142.88,26.04 D8.A 141.6,26.04 141.6,24.77 R32.2 | R31.2 144.15,23.5 | 144.15,23.5 OK8.4 | R30.1 144.15,24.77 | 144.15,24.77 144.15,23.5
  Bottom 0.356: v142.88,26.04 144.15,27.3 v147.96,27.3 149.22,28.57 150.5,28.57 C8.+

### Text on the board
tPlace: NON-ISO BRIDGE: / 5V: 1-4 / GND: 2-3